# EAGLE schematic aqc-rev3 (EAGLE 9.2.2)

## Sheet 1 of 12
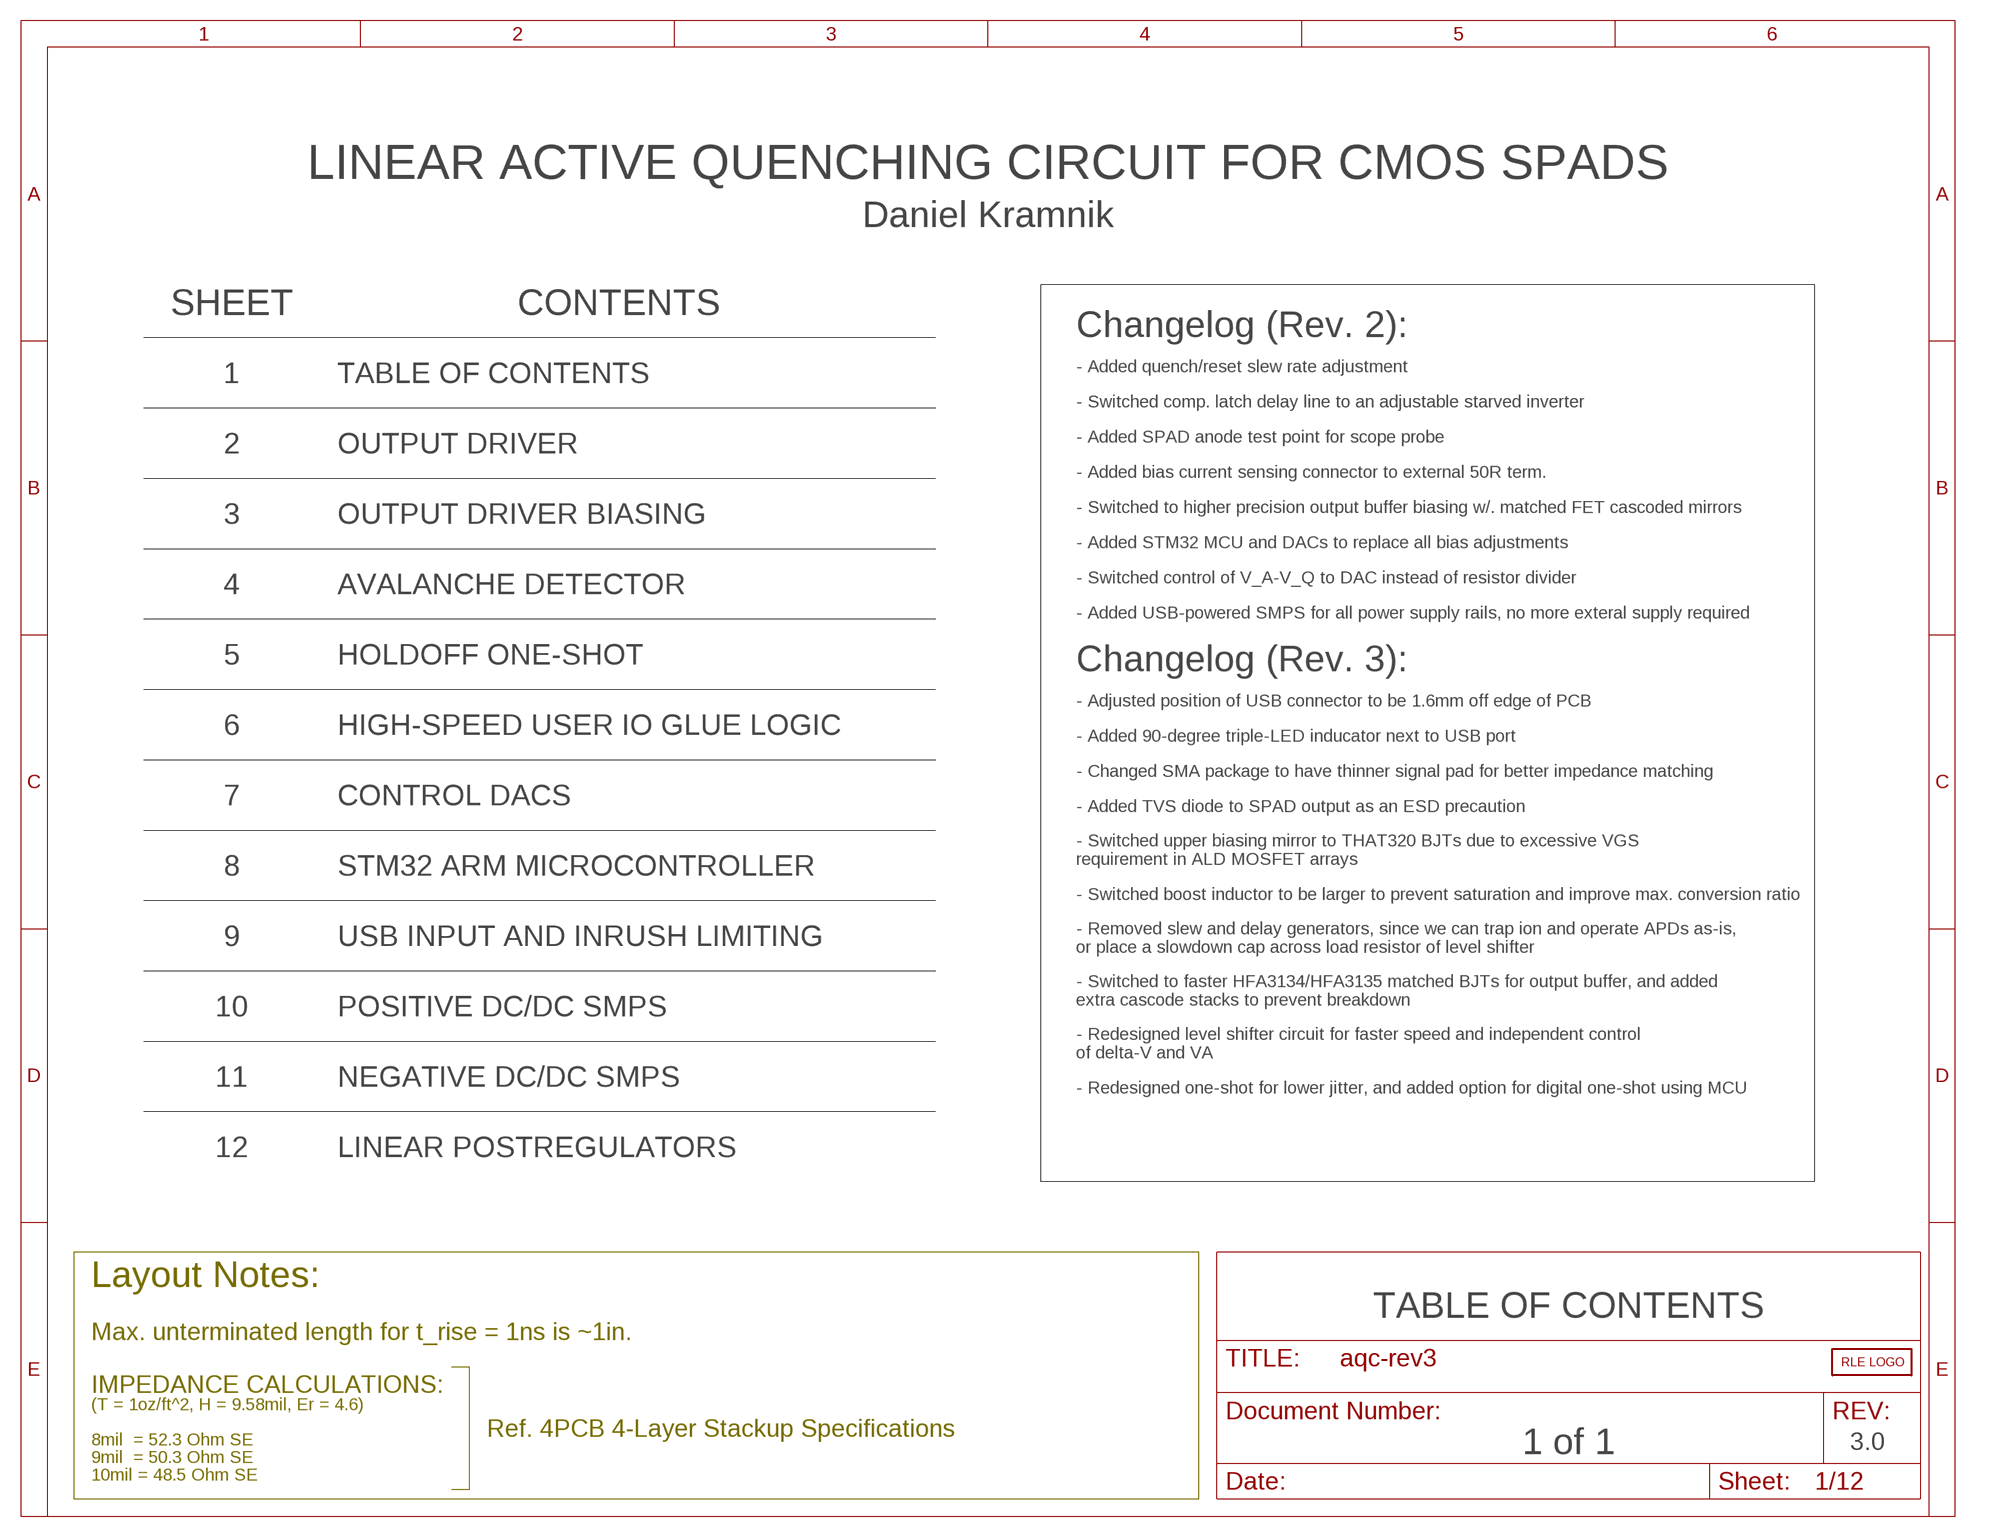
[diagram p0: schematic, sheet 1]

### Parts
DNP1000  RLE_LOGO  [RLE_LOGO]

### Notes on the sheet
- LINEAR ACTIVE QUENCHING CIRCUIT FOR CMOS SPADS
- Daniel Kramnik
- SHEET | CONTENTS
- Changelog (Rev. 2):
- 1 | TABLE OF CONTENTS | - Added quench/reset slew rate adjustment
- - Switched comp. latch delay line to an adjustable starved inverter
- 2 | OUTPUT DRIVER | - Added SPAD anode test point for scope probe
- - Added bias current sensing connector to external 50R term.
- 3 | OUTPUT DRIVER BIASING | - Switched to higher precision output buffer biasing w/. matched FET cascoded mirrors
- - Added STM32 MCU and DACs to replace all bias adjustments
- 4 | AVALANCHE DETECTOR | - Switched control of V_A-V_Q to DAC instead of resistor divider
- - Added USB-powered SMPS for all power supply rails, no more exteral supply required
- 5 | HOLDOFF ONE-SHOT
- Changelog (Rev. 3):
- - Adjusted position of USB connector to be 1.6mm off edge of PCB
- 6 | HIGH-SPEED USER IO GLUE LOGIC
- - Added 90-degree triple-LED inducator next to USB port
- - Changed SMA package to have thinner signal pad for better impedance matching
- 7 | CONTROL DACS
- - Added TVS diode to SPAD output as an ESD precaution
- 8 | STM32 ARM MICROCONTROLLER
- - Switched upper biasing mirror to THAT320 BJTs due to excessive VGS
  requirement in ALD MOSFET arrays
- - Switched boost inductor to be larger to prevent saturation and improve max. conversion ratio
- 9 | USB INPUT AND INRUSH LIMITING
- - Removed slew and delay generators, since we can trap ion and operate APDs as-is,
  or place a slowdown cap across load resistor of level shifter
- 10 | POSITIVE DC/DC SMPS
- - Switched to faster HFA3134/HFA3135 matched BJTs for output buffer, and added
  extra cascode stacks to prevent breakdown
- - Redesigned level shifter circuit for faster speed and independent control
  of delta-V and VA
- 11 | NEGATIVE DC/DC SMPS
- - Redesigned one-shot for lower jitter, and added option for digital one-shot using MCU
- 12 | LINEAR POSTREGULATORS
- Layout Notes:
- TABLE OF CONTENTS
- Max. unterminated length for t_rise = 1ns is ~1in.
- IMPEDANCE CALCULATIONS:
- (T = 1oz/ft^2, H = 9.58mil, Er = 4.6)
- Ref. 4PCB 4-Layer Stackup Specifications | 1 of 1 | 3.0
- 8mil  = 52.3 Ohm SE
- 9mil  = 50.3 Ohm SE
- 10mil = 48.5 Ohm SE

## Sheet 2 of 12
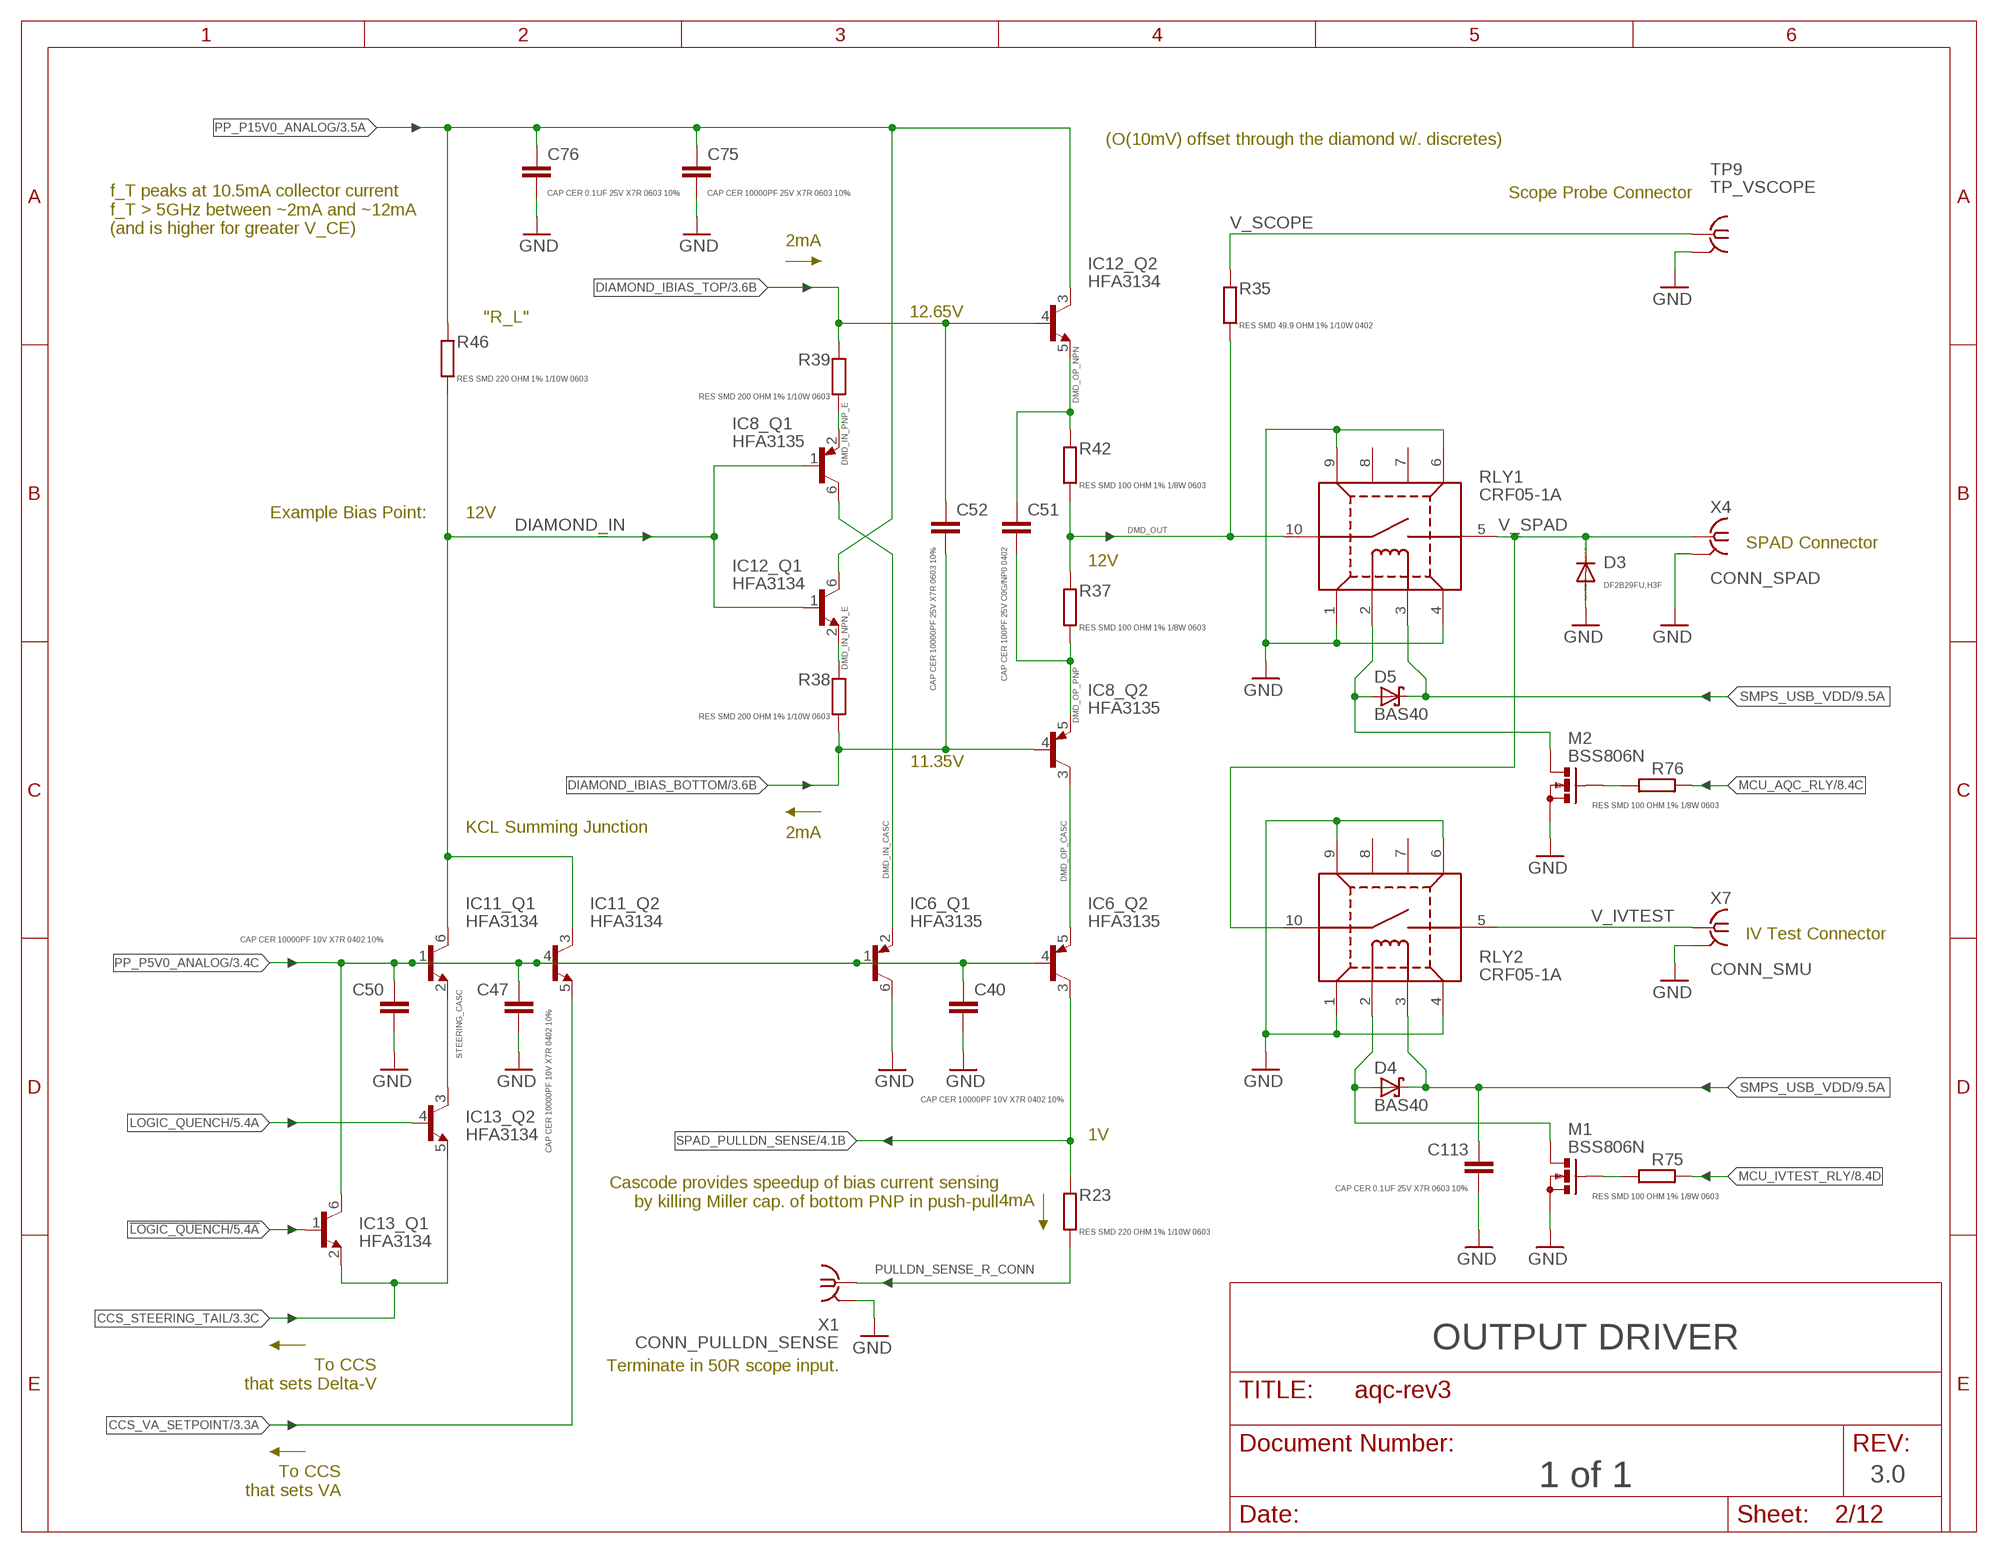
[diagram p1: schematic, sheet 2]

### Parts
C40  CAP CER 10000PF 10V X7R 0402 10%  C-EUC0402  [C0402]
C47  CAP CER 10000PF 10V X7R 0402 10%  C-EUC0402  [C0402]
C50  CAP CER 10000PF 10V X7R 0402 10%  C-EUC0402  [C0402]
C51  CAP CER 100PF 25V C0G/NP0 0402  C-EUC0402  [C0402]
C52  CAP CER 10000PF 25V X7R 0603 10%  C-EUC0603  [C0603]
C75  CAP CER 10000PF 25V X7R 0603 10%  C-EUC0603  [C0603]
C76  CAP CER 0.1UF 25V X7R 0603 10%  C-EUC0603  [C0603]
C113  CAP CER 0.1UF 25V X7R 0603 10%  C-EUC0603  [C0603]
D3  DF2B29FU,H3F  DIODE-SOD523  [SOD523]
D4  BAS40  [SOT23]
D5  BAS40  [SOT23]
IC6  HFA3135  [SOT23-6L]
IC8  HFA3135  [SOT23-6L]
IC11  HFA3134  [SOT23-6L]
IC12  HFA3134  [SOT23-6L]
IC13  HFA3134  [SOT23-6L]
M1  BSS806N  [SOT23R_INFINEON]
M2  BSS806N  [SOT23R_INFINEON]
R23  RES SMD 220 OHM 1% 1/10W 0603  R-EU_R0603  [R0603]
R35  RES SMD 49.9 OHM 1% 1/10W 0402  R-EU_R0402  [R0402]
R37  RES SMD 100 OHM 1% 1/8W 0603  R-EU_R0603  [R0603]
R38  RES SMD 200 OHM 1% 1/10W 0603  R-EU_R0603  [R0603]
R39  RES SMD 200 OHM 1% 1/10W 0603  R-EU_R0603  [R0603]
R42  RES SMD 100 OHM 1% 1/8W 0603  R-EU_R0603  [R0603]
R46  RES SMD 220 OHM 1% 1/10W 0603  R-EU_R0603  [R0603]
R75  RES SMD 100 OHM 1% 1/8W 0603  R-EU_R0603  [R0603]
R76  RES SMD 100 OHM 1% 1/8W 0603  R-EU_R0603  [R0603]
RLY1  CRF05-1A  MEDER_CRF05-1A  [MEDER_RELAY_CRF]
RLY2  CRF05-1A  MEDER_CRF05-1A  [MEDER_RELAY_CRF]
TP9  TP_VSCOPE  TP-SCOPE_H  [JOHNSON-129-0701-30X]
X1  CONN_PULLDN_SENSE  SMA-142-0701-881/886  [J502-ND-142-0701-881/886]
X4  CONN_SPAD  SMA-142-0701-881/886  [J502-ND-142-0701-881/886]
X7  CONN_SMU  SMA-142-0701-881/886  [J502-ND-142-0701-881/886]

### Nets
!LOGIC_QUENCH: IC13.1(_Q1:B) ; also sheet 5
CCS_STEERING_TAIL: IC13.2(_Q1:E) IC13.5(_Q2:E) ; also sheet 3
CCS_VA_SETPOINT: IC11.5(_Q2:E) ; also sheet 3
DIAMOND_IBIAS_BOTTOM: C52.2 IC8.4(_Q2:B) R38.1 ; also sheet 3
DIAMOND_IBIAS_TOP: C52.1 IC12.4(_Q2:B) R39.2 ; also sheet 3
DIAMOND_IN: IC8.1(_Q1:B) IC11.3(_Q2:C) IC11.6(_Q1:C) IC12.1(_Q1:B) R46.1
DMD_IN_CASC: IC6.2(_Q1:E) IC8.6(_Q1:C)
DMD_IN_NPN_E: IC12.2(_Q1:E) R38.2
DMD_IN_PNP_E: IC8.2(_Q1:E) R39.1
DMD_OP_CASC: IC6.5(_Q2:E) IC8.3(_Q2:C)
DMD_OP_NPN: C51.1 IC12.5(_Q2:E) R42.2
DMD_OP_PNP: C51.2 IC8.5(_Q2:E) R37.1
DMD_OUT: R35.1 R37.2 R42.1 RLY1.10(PIN10)
GND: C40.2 C47.2 C50.2 C75.2 C76.2 C113.2 D3.A IC6.6(_Q1:C) M1.2(S) M2.2(S) RLY1.1(PIN1) RLY1.4(PIN4) RLY1.6(PIN6) RLY1.9(PIN9) RLY2.1(PIN1) RLY2.4(PIN4) RLY2.6(PIN6) RLY2.9(PIN9) TP9.GND1(GND) TP9.GND2(GND) X1.G@1(GND) X4.G@1(GND) X7.G@1(GND) ; also sheet 3,4,5,6,7,8,9,10,11,12
LOGIC_QUENCH: IC13.4(_Q2:B) ; also sheet 5
MCU_AQC_RLY: R76.2 ; also sheet 8
MCU_IVTEST_RLY: R75.2 ; also sheet 8
N$3: M2.1(G) R76.1
N$4: D5.1(A) M2.3(D) RLY1.2(PIN2)
N$6: D4.1(A) M1.3(D) RLY2.2(PIN2)
N$15: M1.1(G) R75.1
PP_P5V0_ANALOG: C40.1 C47.1 C50.1 IC6.1(_Q1:B) IC6.4(_Q2:B) IC11.1(_Q1:B) IC11.4(_Q2:B) IC13.6(_Q1:C) ; also sheet 3,4,5,7,12
PP_P15V0_ANALOG: C75.1 C76.1 IC12.3(_Q2:C) IC12.6(_Q1:C) R46.2 ; also sheet 3,12
PULLDN_SENSE_R_CONN: R23.1 X1.1
SMPS_USB_VDD: C113.1 D4.3(C) D5.3(C) RLY1.3(PIN3) RLY2.3(PIN3) ; also sheet 9,10,11
SPAD_PULLDN_SENSE: IC6.3(_Q2:C) R23.2 ; also sheet 4
STEERING_CASC: IC11.2(_Q1:E) IC13.3(_Q2:C)
V_IVTEST: RLY2.5(PIN5) X7.1
V_SCOPE: R35.2 TP9.SIG
V_SPAD: D3.C RLY1.5(PIN5) RLY2.10(PIN10) X4.1
Unconnected: RLY1.7(PIN7) RLY1.8(PIN8) RLY2.7(PIN7) RLY2.8(PIN8)

### Notes on the sheet
- (O(10mV) offset through the diamond w/. discretes)
- Scope Probe Connector
- f_T peaks at 10.5mA collector current
  f_T > 5GHz between ~2mA and ~12mA
  (and is higher for greater V_CE)
- 2mA
- 12.65V
- "R_L"
- Example Bias Point: | 12V
- SPAD Connector
- 12V
- 11.35V
- KCL Summing Junction
- 2mA
- IV Test Connector
- 1V
- Cascode provides speedup of bias current sensing
  by killing Miller cap. of bottom PNP in push-pull
- 4mA
- OUTPUT DRIVER
- Terminate in 50R scope input.
- To CCS
  that sets Delta-V
- 1 of 1 | 3.0
- To CCS
  that sets VA

## Sheet 3 of 12
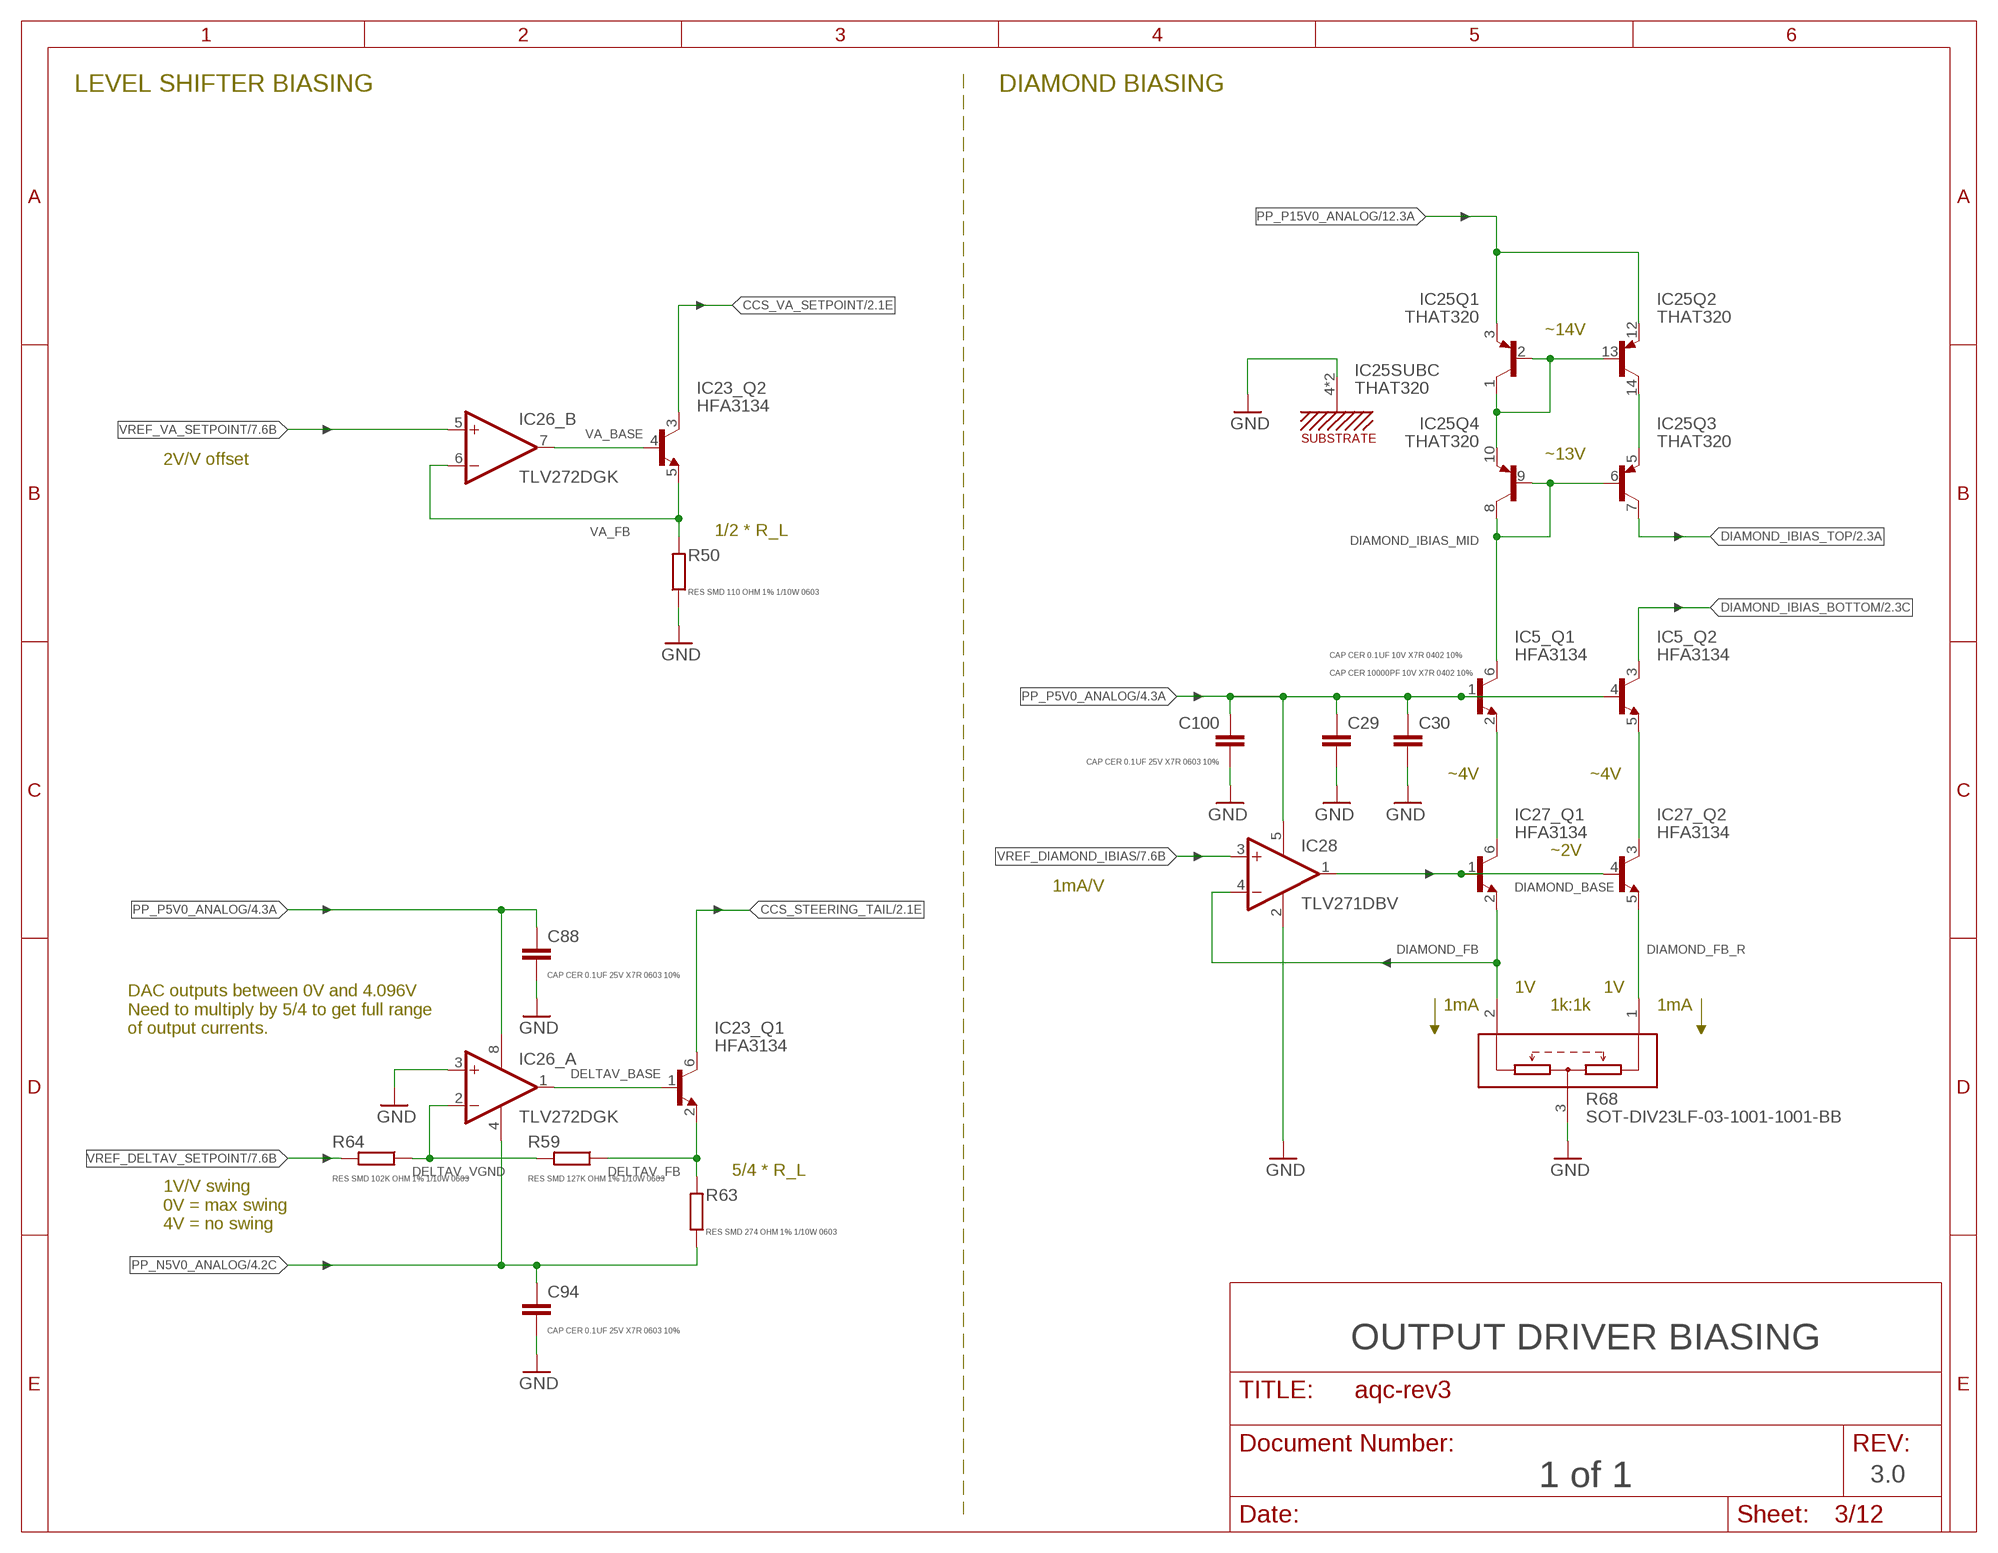
[diagram p2: schematic, sheet 3]

### Parts
C29  CAP CER 0.1UF 10V X7R 0402 10%  C-EUC0402  [C0402]
C30  CAP CER 10000PF 10V X7R 0402 10%  C-EUC0402  [C0402]
C88  CAP CER 0.1UF 25V X7R 0603 10%  C-EUC0603  [C0603]
C94  CAP CER 0.1UF 25V X7R 0603 10%  C-EUC0603  [C0603]
C100  CAP CER 0.1UF 25V X7R 0603 10%  C-EUC0603  [C0603]
IC5  HFA3134  [SOT23-6L]
IC23  HFA3134  [SOT23-6L]
IC25  THAT320  [SO14]
IC26  TLV272DGK  [MSOP8]
IC27  HFA3134  [SOT23-6L]
IC28  TLV271DBV  [SOT23-5]
R50  RES SMD 110 OHM 1% 1/10W 0603  R-EU_R0603  [R0603]
R59  RES SMD 127K OHM 1% 1/10W 0603  R-EU_R0603  [R0603]
R63  RES SMD 274 OHM 1% 1/10W 0603  R-EU_R0603  [R0603]
R64  RES SMD 102K OHM 1% 1/10W 0603  R-EU_R0603  [R0603]
R68  SOT-DIV23LF-03-1001-1001-BB  DIVIDER_SOT23-5  [SOT23C]

### Nets
CCS_STEERING_TAIL: IC23.6(_Q1:C) ; also sheet 2
CCS_VA_SETPOINT: IC23.3(_Q2:C) ; also sheet 2
DELTAV_BASE: IC23.1(_Q1:B) IC26.1(_A:OUT)
DELTAV_FB: IC23.2(_Q1:E) R59.1 R63.2
DELTAV_VGND: IC26.2(_A:-IN) R59.2 R64.1
DIAMOND_BASE: IC27.1(_Q1:B) IC27.4(_Q2:B) IC28.1(OUT)
DIAMOND_FB: IC27.2(_Q1:E) IC28.4(-IN) R68.2(TOP)
DIAMOND_FB_R: IC27.5(_Q2:E) R68.1(BOTTOM)
DIAMOND_IBIAS_BOTTOM: IC5.3(_Q2:C) ; also sheet 2
DIAMOND_IBIAS_MID: IC5.6(_Q1:C) IC25.6(Q3:B) IC25.8(Q4:C) IC25.9(Q4:B)
DIAMOND_IBIAS_TOP: IC25.7(Q3:C) ; also sheet 2
GND: C29.2 C30.2 C88.2 C94.2 C100.2 IC25.4(SUBC:SUBC) IC25.11(SUBC:SUBC) IC26.3(_A:+IN) IC28.2(V-) R50.1 R68.3(MIDDLE) ; also sheet 2,4,5,6,7,8,9,10,11,12
N$16: IC5.2(_Q1:E) IC27.6(_Q1:C)
N$26: IC5.5(_Q2:E) IC27.3(_Q2:C)
N$88: IC25.1(Q1:C) IC25.2(Q1:B) IC25.10(Q4:E) IC25.13(Q2:B)
N$89: IC25.5(Q3:E) IC25.14(Q2:C)
PP_N5V0_ANALOG: C94.1 IC26.4(_A:V-) R63.1 ; also sheet 4,5,12
PP_P5V0_ANALOG: C29.1 C30.1 C88.1 C100.1 IC5.1(_Q1:B) IC5.4(_Q2:B) IC26.8(_A:V+) IC28.5(V+) ; also sheet 2,4,5,7,12
PP_P15V0_ANALOG: IC25.3(Q1:E) IC25.12(Q2:E) ; also sheet 2,12
VA_BASE: IC23.4(_Q2:B) IC26.7(_B:OUT)
VA_FB: IC23.5(_Q2:E) IC26.6(_B:-IN) R50.2
VREF_DELTAV_SETPOINT: R64.2 ; also sheet 7
VREF_DIAMOND_IBIAS: IC28.3(+IN) ; also sheet 7
VREF_VA_SETPOINT: IC26.5(_B:+IN) ; also sheet 7

### Notes on the sheet
- LEVEL SHIFTER BIASING | DIAMOND BIASING
- ~14V
- ~13V
- 2V/V offset
- 1/2 * R_L
- ~4V | ~4V
- ~2V
- 1mA/V
- 1V | 1V
- 1mA | 1k:1k | 1mA
- DAC outputs between 0V and 4.096V
  Need to multiply by 5/4 to get full range
  of output currents.
- 5/4 * R_L
- 1V/V swing
  0V = max swing
  4V = no swing
- OUTPUT DRIVER BIASING
- 1 of 1 | 3.0

## Sheet 4 of 12
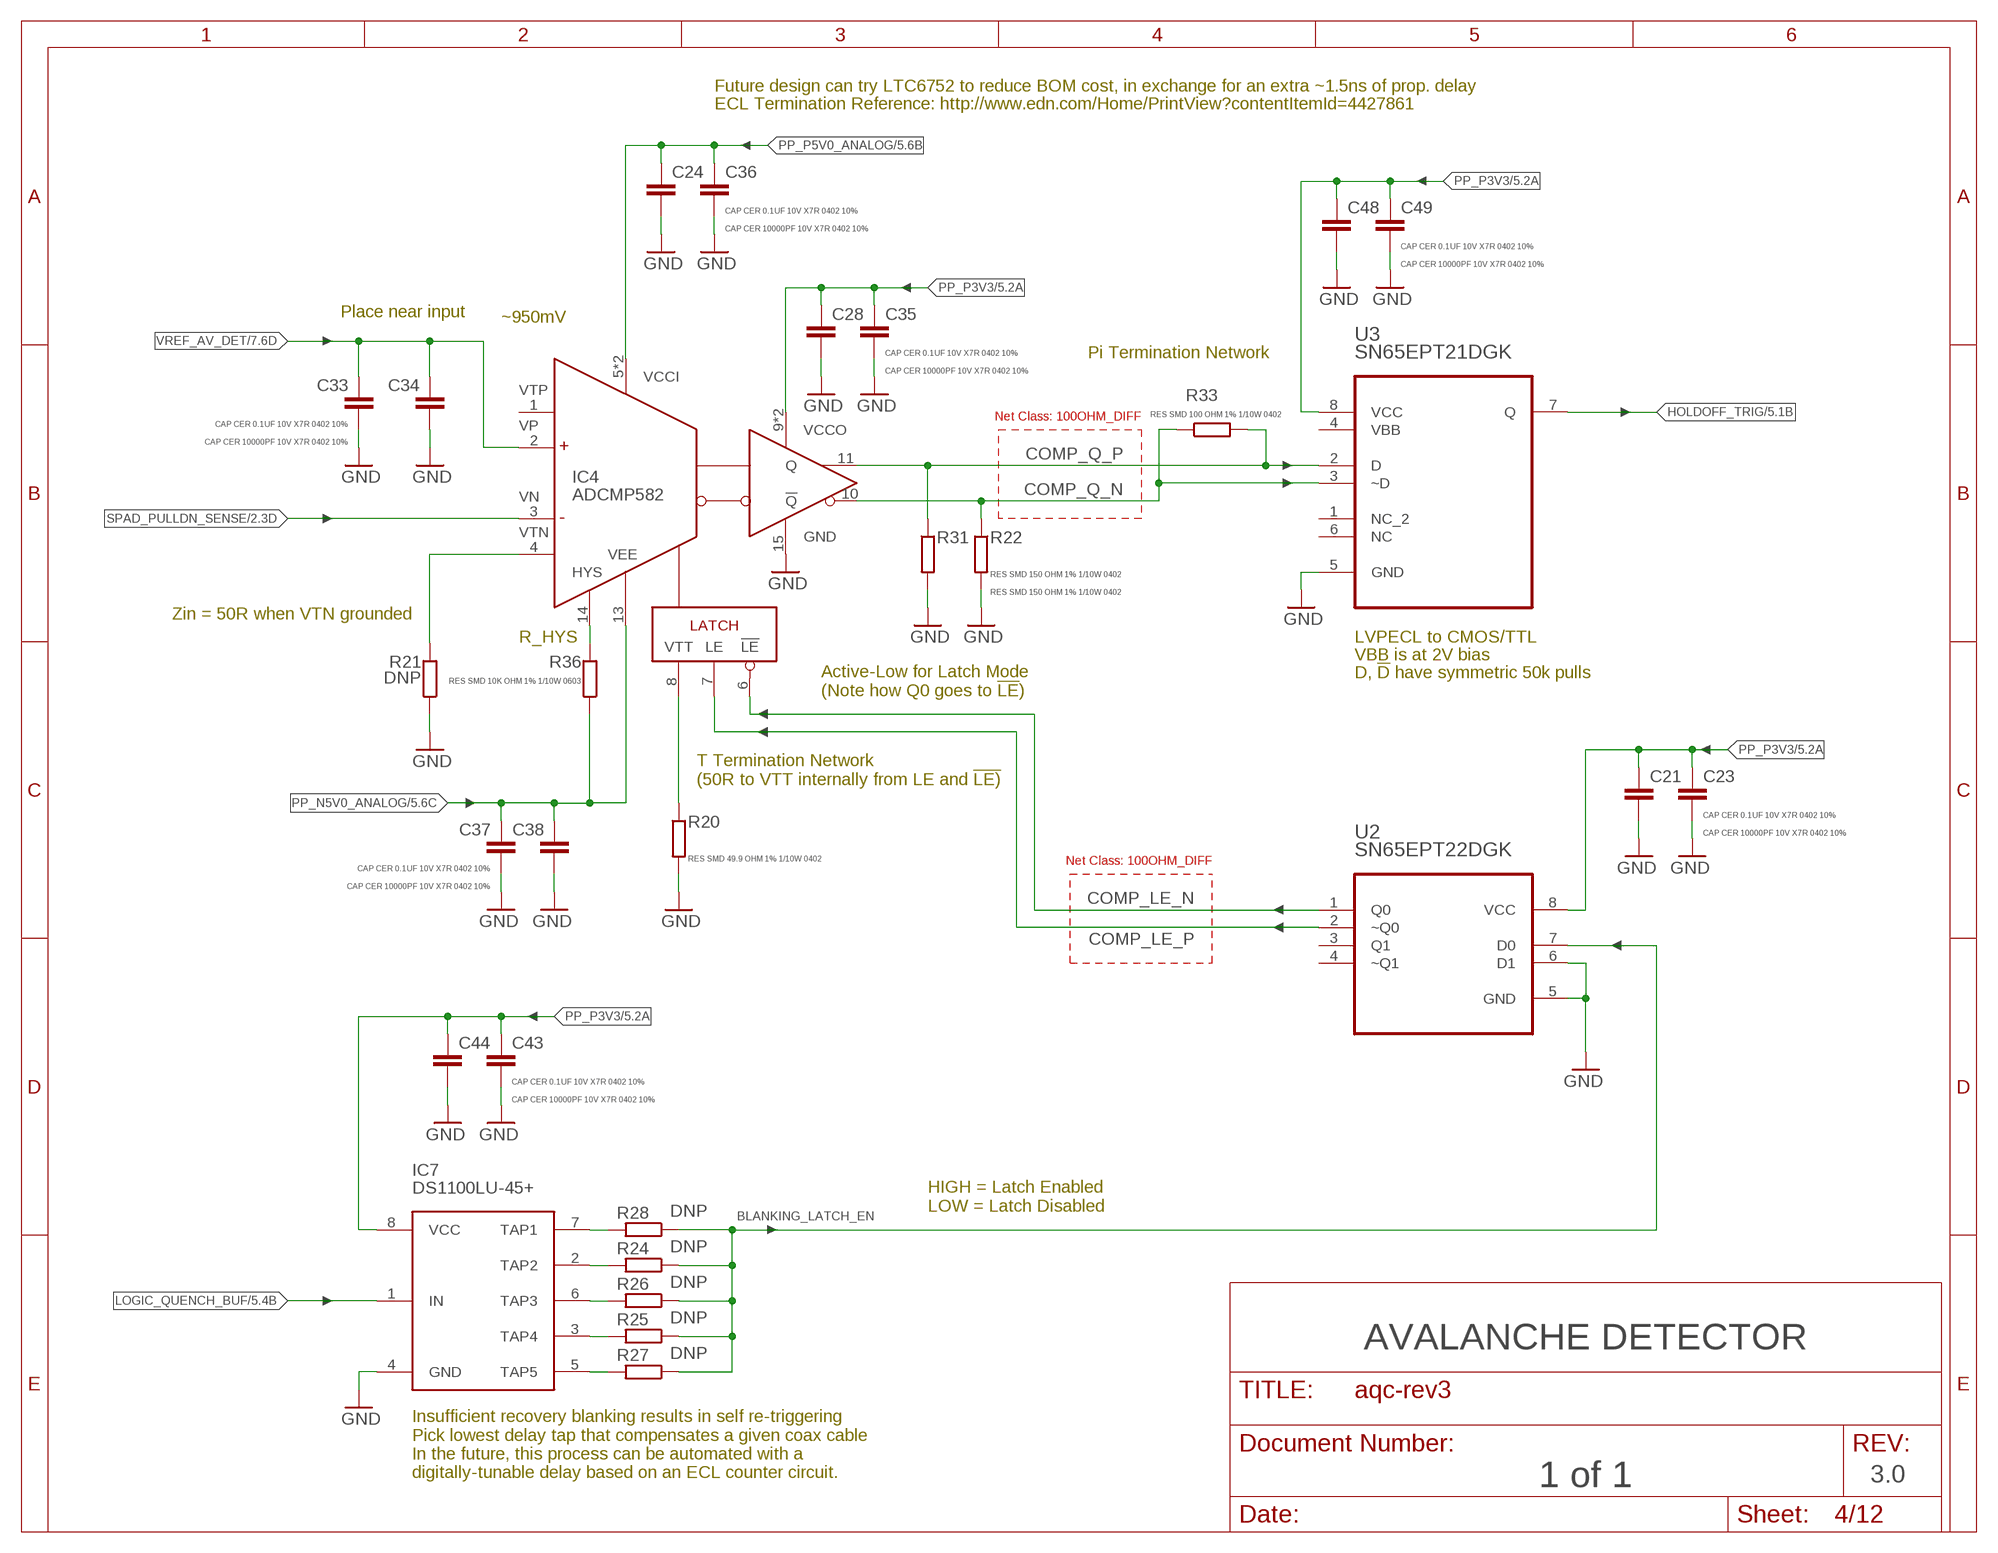
[diagram p3: schematic, sheet 4]

### Parts
C21  CAP CER 10000PF 10V X7R 0402 10%  C-EUC0402  [C0402]
C23  CAP CER 0.1UF 10V X7R 0402 10%  C-EUC0402  [C0402]
C24  CAP CER 10000PF 10V X7R 0402 10%  C-EUC0402  [C0402]
C28  CAP CER 10000PF 10V X7R 0402 10%  C-EUC0402  [C0402]
C33  CAP CER 0.1UF 10V X7R 0402 10%  C-EUC0402  [C0402]
C34  CAP CER 10000PF 10V X7R 0402 10%  C-EUC0402  [C0402]
C35  CAP CER 0.1UF 10V X7R 0402 10%  C-EUC0402  [C0402]
C36  CAP CER 0.1UF 10V X7R 0402 10%  C-EUC0402  [C0402]
C37  CAP CER 0.1UF 10V X7R 0402 10%  C-EUC0402  [C0402]
C38  CAP CER 10000PF 10V X7R 0402 10%  C-EUC0402  [C0402]
C43  CAP CER 0.1UF 10V X7R 0402 10%  C-EUC0402  [C0402]
C44  CAP CER 10000PF 10V X7R 0402 10%  C-EUC0402  [C0402]
C48  CAP CER 10000PF 10V X7R 0402 10%  C-EUC0402  [C0402]
C49  CAP CER 0.1UF 10V X7R 0402 10%  C-EUC0402  [C0402]
IC4  ADCMP582  [QFN50P300X300X80-16N]
IC7  DS1100LU-45+  DS1100L  [MSOP8]
R20  RES SMD 49.9 OHM 1% 1/10W 0402  R-EU_R0402  [R0402]
R21  DNP  R-EU_R0603  [R0603]
R22  RES SMD 150 OHM 1% 1/10W 0402  R-EU_R0402  [R0402]
R24  DNP  R-EU_R0603  [R0603]
R25  DNP  R-EU_R0603  [R0603]
R26  DNP  R-EU_R0603  [R0603]
R27  DNP  R-EU_R0603  [R0603]
R28  DNP  R-EU_R0603  [R0603]
R31  RES SMD 150 OHM 1% 1/10W 0402  R-EU_R0402  [R0402]
R33  RES SMD 100 OHM 1% 1/10W 0402  R-EU_R0402  [R0402]
R36  RES SMD 10K OHM 1% 1/10W 0603  R-EU_R0603  [R0603]
U2  SN65EPT22DGK  [SOP65P490X110-8N]
U3  SN65EPT21DGK  [SOP65P490X110-8N]

### Nets
BLANKING_LATCH_EN: R24.1 R25.1 R26.1 R27.1 R28.1 U2.7(D0)
COMP_HYS: IC4.14(HYS) R36.2
COMP_LE_N [100OHM_DIFF]: IC4.6(!LE) U2.1(Q0)
COMP_LE_P [100OHM_DIFF]: IC4.7(LE) U2.2(~Q0)
COMP_Q_N [100OHM_DIFF]: IC4.10(!Q) R22.1 R33.1 U3.3(~D)
COMP_Q_P [100OHM_DIFF]: IC4.11(Q) R31.1 R33.2 U3.2(D)
COMP_VTN: IC4.4(VTN) R21.2
COMP_VTT: IC4.8(VTT) R20.1
GND: C21.2 C23.2 C24.2 C28.2 C33.2 C34.2 C35.2 C36.2 C37.2 C38.2 C43.2 C44.2 C48.2 C49.2 IC4.15(GND) IC7.4(GND) R20.2 R21.1 R22.2 R31.2 U2.5(GND) U2.6(D1) U3.5(GND) ; also sheet 2,3,5,6,7,8,9,10,11,12
HOLDOFF_TRIG: U3.7(Q) ; also sheet 5
LOGIC_QUENCH_BUF: IC7.1(IN) ; also sheet 5,6
PP_N5V0_ANALOG: C37.1 C38.1 IC4.13(VEE) R36.1 ; also sheet 3,5,12
PP_P3V3: C21.1 C23.1 C28.1 C35.1 C43.1 C44.1 C48.1 C49.1 IC4.9(VCCO) IC4.12(VCCO) IC7.8(VCC) U2.8(VCC) U3.8(VCC) ; also sheet 5,6,7,8,9
PP_P5V0_ANALOG: C24.1 C36.1 IC4.5(VCCI) IC4.16(VCCI) ; also sheet 2,3,5,7,12
SPAD_PULLDN_SENSE: IC4.3(VN) ; also sheet 2
TAP1: IC7.7(TAP1) R28.2
TAP2: IC7.2(TAP2) R24.2
TAP3: IC7.6(TAP3) R26.2
TAP4: IC7.3(TAP4) R25.2
TAP5: IC7.5(TAP5) R27.2
VREF_AV_DET: C33.1 C34.1 IC4.2(VP) ; also sheet 7
Unconnected: IC4.1(VTP) U2.3(Q1) U2.4(~Q1) U3.1(NC_2) U3.6(NC)

### Notes on the sheet
- Future design can try LTC6752 to reduce BOM cost, in exchange for an extra ~1.5ns of prop. delay
- ECL Termination Reference: http://www.edn.com/Home/PrintView?contentItemId=4427861
- Place near input
- ~950mV
- Pi Termination Network
- Net Class: 100OHM_DIFF
- Zin = 50R when VTN grounded
- R_HYS | LVPECL to CMOS/TTL
- VBB is at 2V bias
- D, !D! have symmetric 50k pulls
- Active-Low for Latch Mode
  (Note how Q0 goes to !LE!)
- T Termination Network
  (50R to VTT internally from LE and !LE)
- Net Class: 100OHM_DIFF
- HIGH = Latch Enabled
  LOW = Latch Disabled
- AVALANCHE DETECTOR
- 1 of 1 | 3.0
- Insufficient recovery blanking results in self re-triggering
  Pick lowest delay tap that compensates a given coax cable
  In the future, this process can be automated with a
  digitally-tunable delay based on an ECL counter circuit.

## Sheet 5 of 12
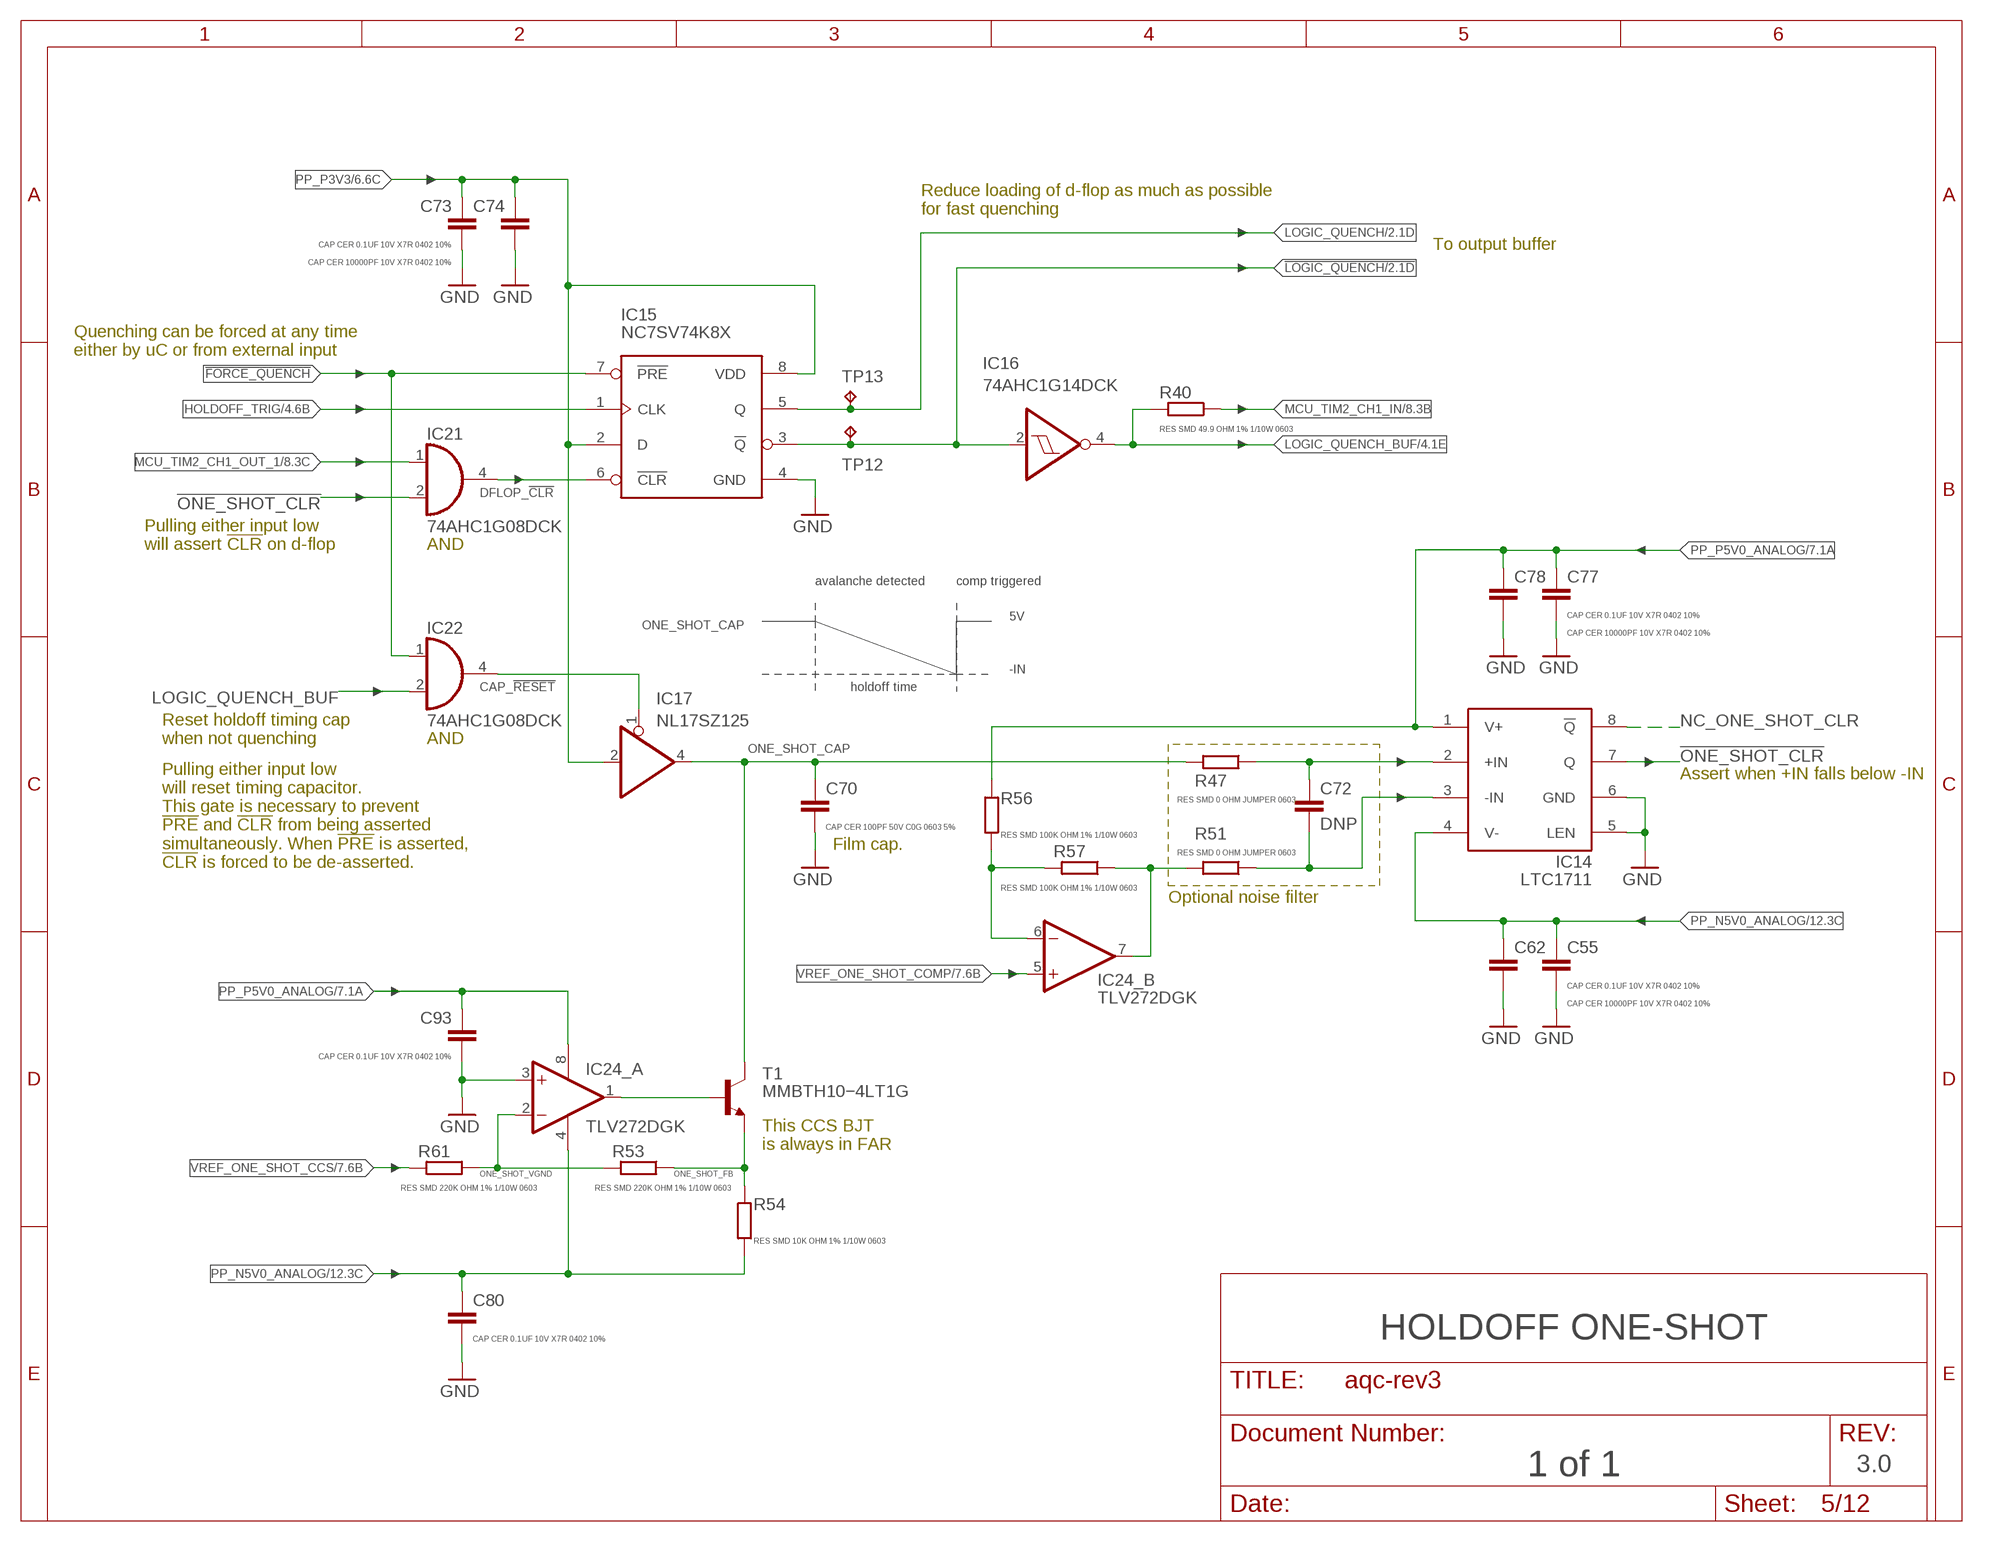
[diagram p4: schematic, sheet 5]

### Parts
C55  CAP CER 0.1UF 10V X7R 0402 10%  C-EUC0402  [C0402]
C62  CAP CER 10000PF 10V X7R 0402 10%  C-EUC0402  [C0402]
C70  CAP CER 100PF 50V C0G 0603 5%  C-EUC0603  [C0603]
C72  DNP  C-EUC0402  [C0402]
C73  CAP CER 0.1UF 10V X7R 0402 10%  C-EUC0402  [C0402]
C74  CAP CER 10000PF 10V X7R 0402 10%  C-EUC0402  [C0402]
C77  CAP CER 0.1UF 10V X7R 0402 10%  C-EUC0402  [C0402]
C78  CAP CER 10000PF 10V X7R 0402 10%  C-EUC0402  [C0402]
C80  CAP CER 0.1UF 10V X7R 0402 10%  C-EUC0402  [C0402]
C93  CAP CER 0.1UF 10V X7R 0402 10%  C-EUC0402  [C0402]
IC14  LTC1711  [MSOP8]
IC15  NC7SV74K8X  [US8_3.1MM_JDEC_MO-187]
IC16  74AHC1G14DCK  [SC70-5]
IC17  NL17SZ125  74AHC1G125DCK  [SC70-5]
IC21  74AHC1G08DCK  [SC70-5]
IC22  74AHC1G08DCK  [SC70-5]
IC24  TLV272DGK  [MSOP8]
R40  RES SMD 49.9 OHM 1% 1/10W 0603  R-EU_R0603  [R0603]
R47  RES SMD 0 OHM JUMPER 0603  R-EU_R0603  [R0603]
R51  RES SMD 0 OHM JUMPER 0603  R-EU_R0603  [R0603]
R53  RES SMD 220K OHM 1% 1/10W 0603  R-EU_R0603  [R0603]
R54  RES SMD 10K OHM 1% 1/10W 0603  R-EU_R0603  [R0603]
R56  RES SMD 100K OHM 1% 1/10W 0603  R-EU_R0603  [R0603]
R57  RES SMD 100K OHM 1% 1/10W 0603  R-EU_R0603  [R0603]
R61  RES SMD 220K OHM 1% 1/10W 0603  R-EU_R0603  [R0603]
T1  MMBTH10−4LT1G  MMBTH10LT1-NPN-SOT23-BEC  [SOT23-BEC]
TP12  TPTP06R  [TP06R]
TP13  TPTP06R  [TP06R]

### Nets
!FORCE_QUENCH: IC15.7(!PRE) IC22.1(I0) ; also sheet 6
!LOGIC_QUENCH: IC15.3(!Q) IC16.2(I) TP12.TP ; also sheet 2
!ONE_SHOT_CLR: IC14.7(Q) IC21.2(I1)
CAP_!RESET: IC17.1(OE) IC22.4(O)
DFLOP_!CLR: IC15.6(!CLR) IC21.4(O)
GND: C55.2 C62.2 C70.2 C73.2 C74.2 C77.2 C78.2 C80.2 C93.2 IC14.5(LEN) IC14.6(GND) IC15.4(GND) IC24.3(_A:+IN) ; also sheet 2,3,4,6,7,8,9,10,11,12
HOLDOFF_TRIG: IC15.1(CLK) ; also sheet 4
LOGIC_QUENCH: IC15.5(Q) TP13.TP ; also sheet 2
LOGIC_QUENCH_BUF: IC16.4(O) IC22.2(I1) R40.2 ; also sheet 4,6
MCU_TIM2_CH1_IN: R40.1 ; also sheet 8
MCU_TIM2_CH1_OUT_1: IC21.1(I0) ; also sheet 8
N$5: IC24.1(_A:OUT) T1.B
N$7: IC24.7(_B:OUT) R51.2 R57.1
N$10: IC24.6(_B:-IN) R56.1 R57.2
N$11: C72.2 IC14.3(-IN) R51.1
N$13: C72.1 IC14.2(+IN) R47.1
NC_ONE_SHOT_CLR: IC14.8(!Q)
ONE_SHOT_CAP: C70.1 IC17.4(O) R47.2 T1.C
ONE_SHOT_FB: R53.1 R54.1 T1.E
ONE_SHOT_VGND: IC24.2(_A:-IN) R53.2 R61.1
PP_N5V0_ANALOG: C55.1 C62.1 C80.1 IC14.4(V-) IC24.4(_A:V-) R54.2 ; also sheet 3,4,12
PP_P3V3: C73.1 C74.1 IC15.2(D) IC15.8(VDD) IC17.2(I) ; also sheet 4,6,7,8,9
PP_P5V0_ANALOG: C77.1 C78.1 C93.1 IC14.1(V+) IC24.8(_A:V+) R56.2 ; also sheet 2,3,4,7,12
VREF_ONE_SHOT_CCS: R61.2 ; also sheet 7
VREF_ONE_SHOT_COMP: IC24.5(_B:+IN) ; also sheet 7

### Notes on the sheet
- Reduce loading of d-flop as much as possible
  for fast quenching
- To output buffer
- Quenching can be forced at any time
  either by uC or from external input
- Pulling either input low
  will assert !CLR! on d-flop
- AND
- avalanche detected | comp triggered
- ONE_SHOT_CAP | 5V
- -IN
- holdoff time
- Reset holdoff timing cap
  when not quenching
- AND
- Assert when +IN falls below -IN
- Film cap.
- Pulling either input low
  will reset timing capacitor.
  This gate is necessary to prevent
  !PRE! and !CLR! from being asserted
  simultaneously. When !PRE! is asserted,
  !CLR! is forced to be de-asserted.
- Optional noise filter
- This CCS BJT
  is always in FAR
- HOLDOFF ONE-SHOT
- 1 of 1 | 3.0

## Sheet 6 of 12
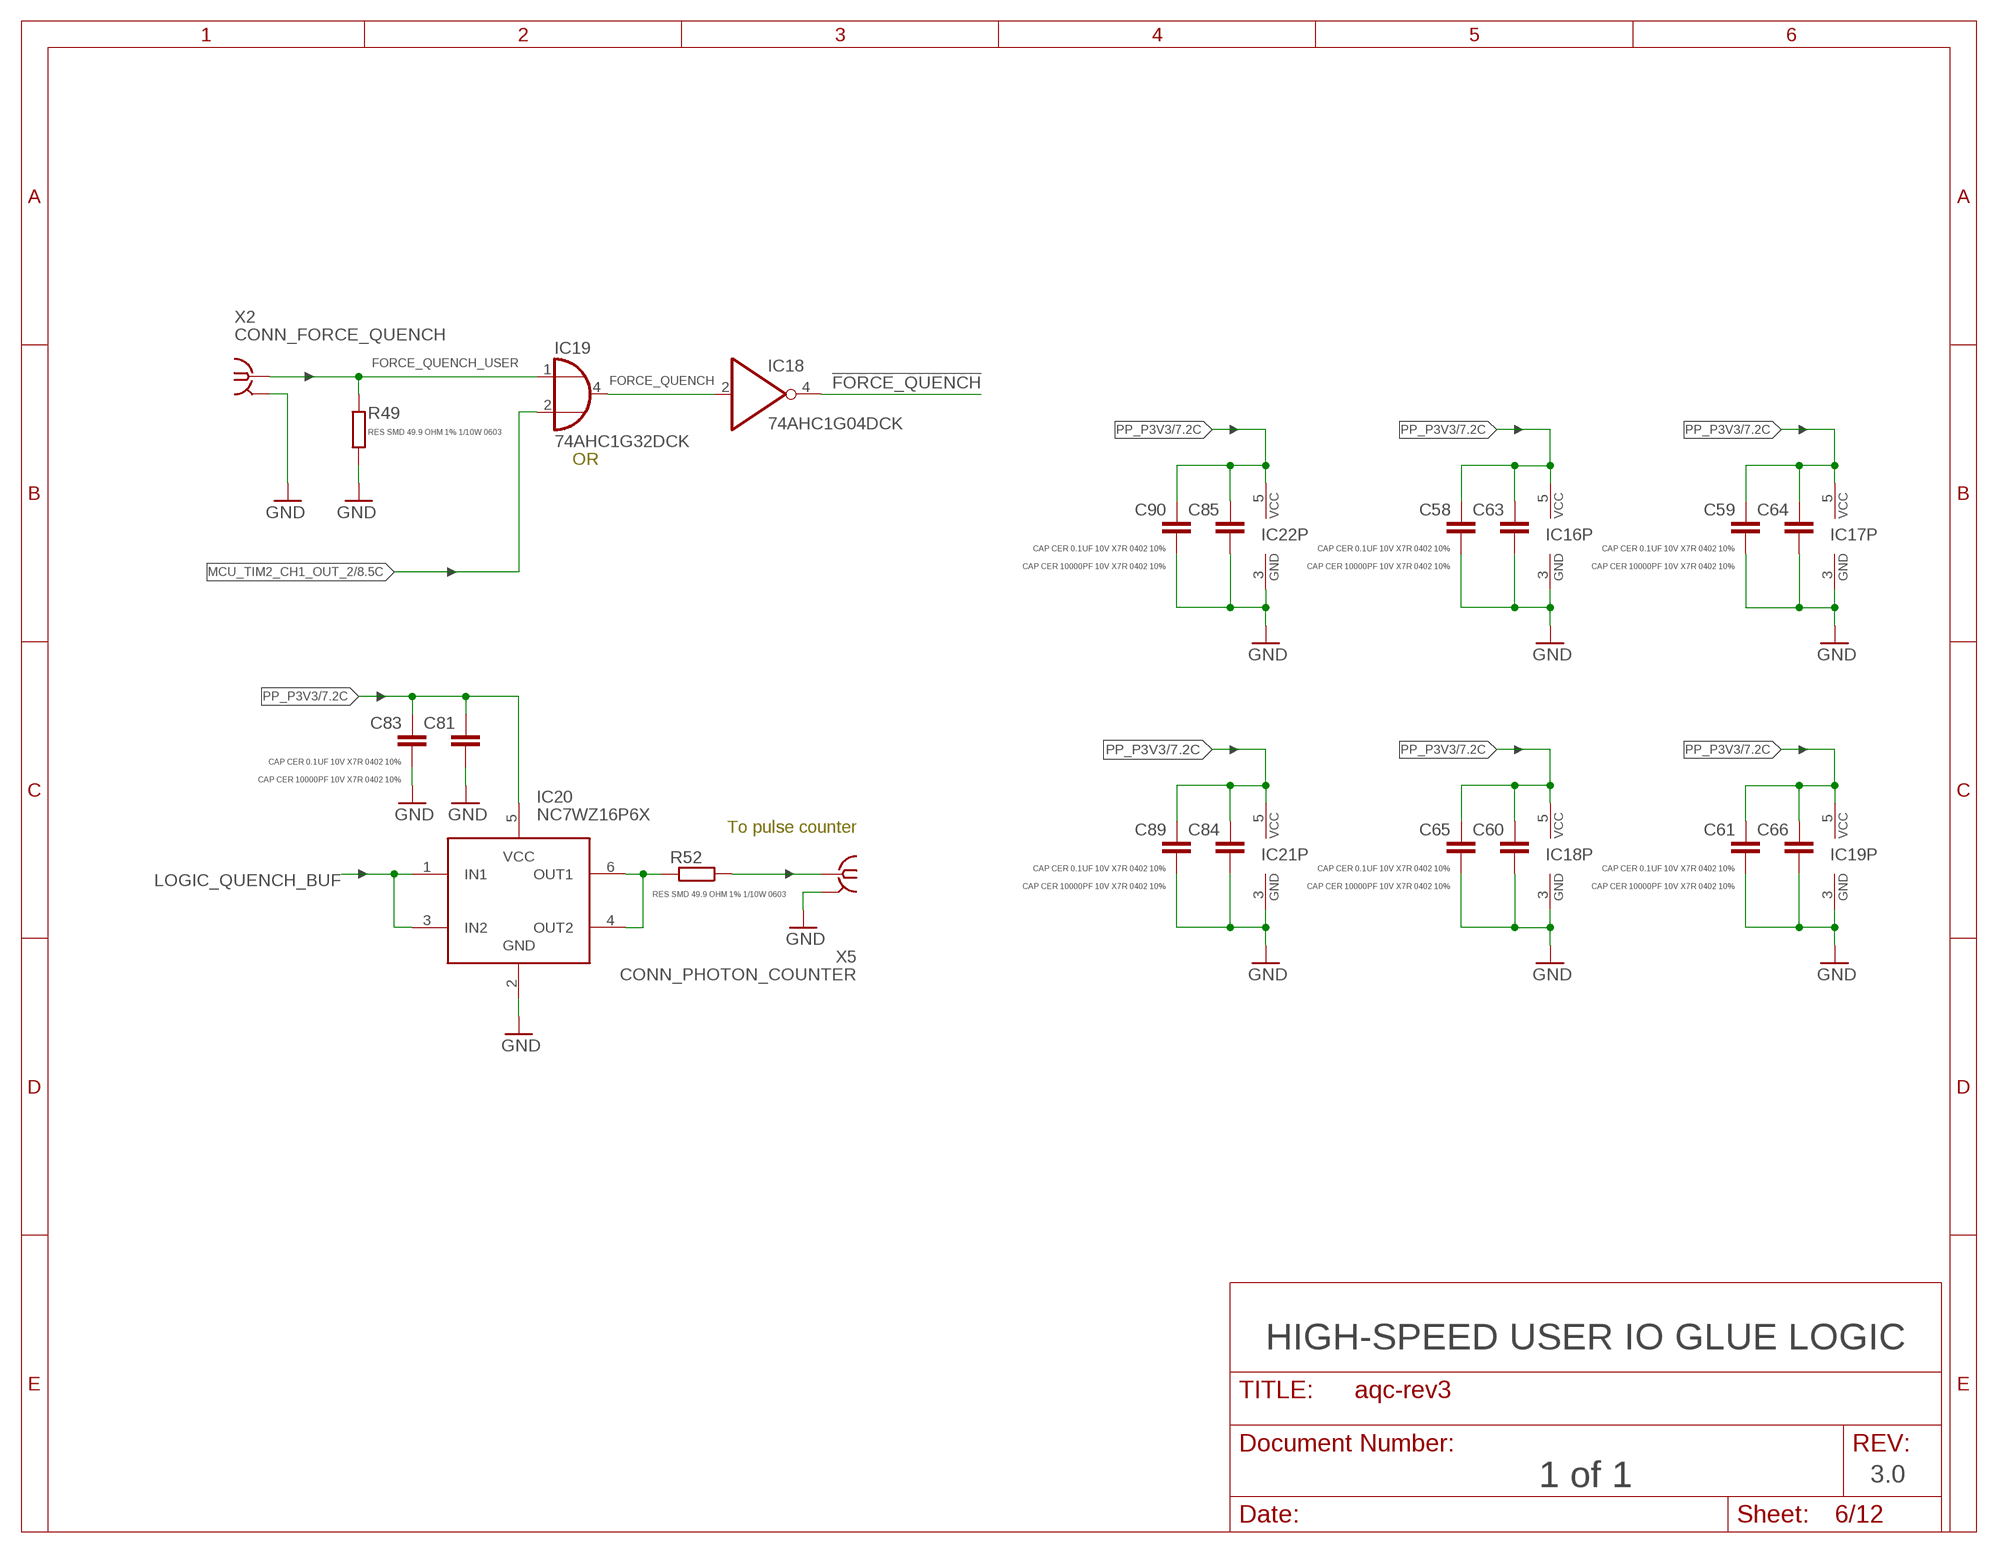
[diagram p5: schematic, sheet 6]

### Parts
C58  CAP CER 0.1UF 10V X7R 0402 10%  C-EUC0402  [C0402]
C59  CAP CER 0.1UF 10V X7R 0402 10%  C-EUC0402  [C0402]
C60  CAP CER 10000PF 10V X7R 0402 10%  C-EUC0402  [C0402]
C61  CAP CER 0.1UF 10V X7R 0402 10%  C-EUC0402  [C0402]
C63  CAP CER 10000PF 10V X7R 0402 10%  C-EUC0402  [C0402]
C64  CAP CER 10000PF 10V X7R 0402 10%  C-EUC0402  [C0402]
C65  CAP CER 0.1UF 10V X7R 0402 10%  C-EUC0402  [C0402]
C66  CAP CER 10000PF 10V X7R 0402 10%  C-EUC0402  [C0402]
C81  CAP CER 10000PF 10V X7R 0402 10%  C-EUC0402  [C0402]
C83  CAP CER 0.1UF 10V X7R 0402 10%  C-EUC0402  [C0402]
C84  CAP CER 10000PF 10V X7R 0402 10%  C-EUC0402  [C0402]
C85  CAP CER 10000PF 10V X7R 0402 10%  C-EUC0402  [C0402]
C89  CAP CER 0.1UF 10V X7R 0402 10%  C-EUC0402  [C0402]
C90  CAP CER 0.1UF 10V X7R 0402 10%  C-EUC0402  [C0402]
IC18  74AHC1G04DCK  [SC70-5]
IC19  74AHC1G32DCK  [SC70-5]
IC20  NC7WZ16P6X  [SC70-6L]
R49  RES SMD 49.9 OHM 1% 1/10W 0603  R-EU_R0603  [R0603]
R52  RES SMD 49.9 OHM 1% 1/10W 0603  R-EU_R0603  [R0603]
X2  CONN_FORCE_QUENCH  SMA-142-0701-881/886  [J502-ND-142-0701-881/886]
X5  CONN_PHOTON_COUNTER  SMA-142-0701-881/886  [J502-ND-142-0701-881/886]

### Nets
!FORCE_QUENCH: IC18.4(O) ; also sheet 5
FORCE_QUENCH: IC18.2(I) IC19.4(O)
FORCE_QUENCH_USER: IC19.1(I0) R49.2 X2.1
GND: C58.2 C59.2 C60.2 C61.2 C63.2 C64.2 C65.2 C66.2 C81.2 C83.2 C84.2 C85.2 C89.2 C90.2 IC16.3(GND) IC17.3(GND) IC18.3(GND) IC19.3(GND) IC20.2(GND) IC21.3(GND) IC22.3(GND) R49.1 X2.G@1(GND) X5.G@1(GND) ; also sheet 2,3,4,5,7,8,9,10,11,12
LOGIC_QUENCH_BUF: IC20.1(IN1) IC20.3(IN2) ; also sheet 4,5
MCU_TIM2_CH1_OUT_2: IC19.2(I1) ; also sheet 8
N$29: IC20.4(OUT2) IC20.6(OUT1) R52.2
PHOTON_COUNT_OUT: R52.1 X5.1
PP_P3V3: C58.1 C59.1 C60.1 C61.1 C63.1 C64.1 C65.1 C66.1 C81.1 C83.1 C84.1 C85.1 C89.1 C90.1 IC16.5(VCC) IC17.5(VCC) IC18.5(VCC) IC19.5(VCC) IC20.5(VCC) IC21.5(VCC) IC22.5(VCC) ; also sheet 4,5,7,8,9

### Notes on the sheet
- OR
- To pulse counter
- HIGH-SPEED USER IO GLUE LOGIC
- 1 of 1 | 3.0

## Sheet 7 of 12
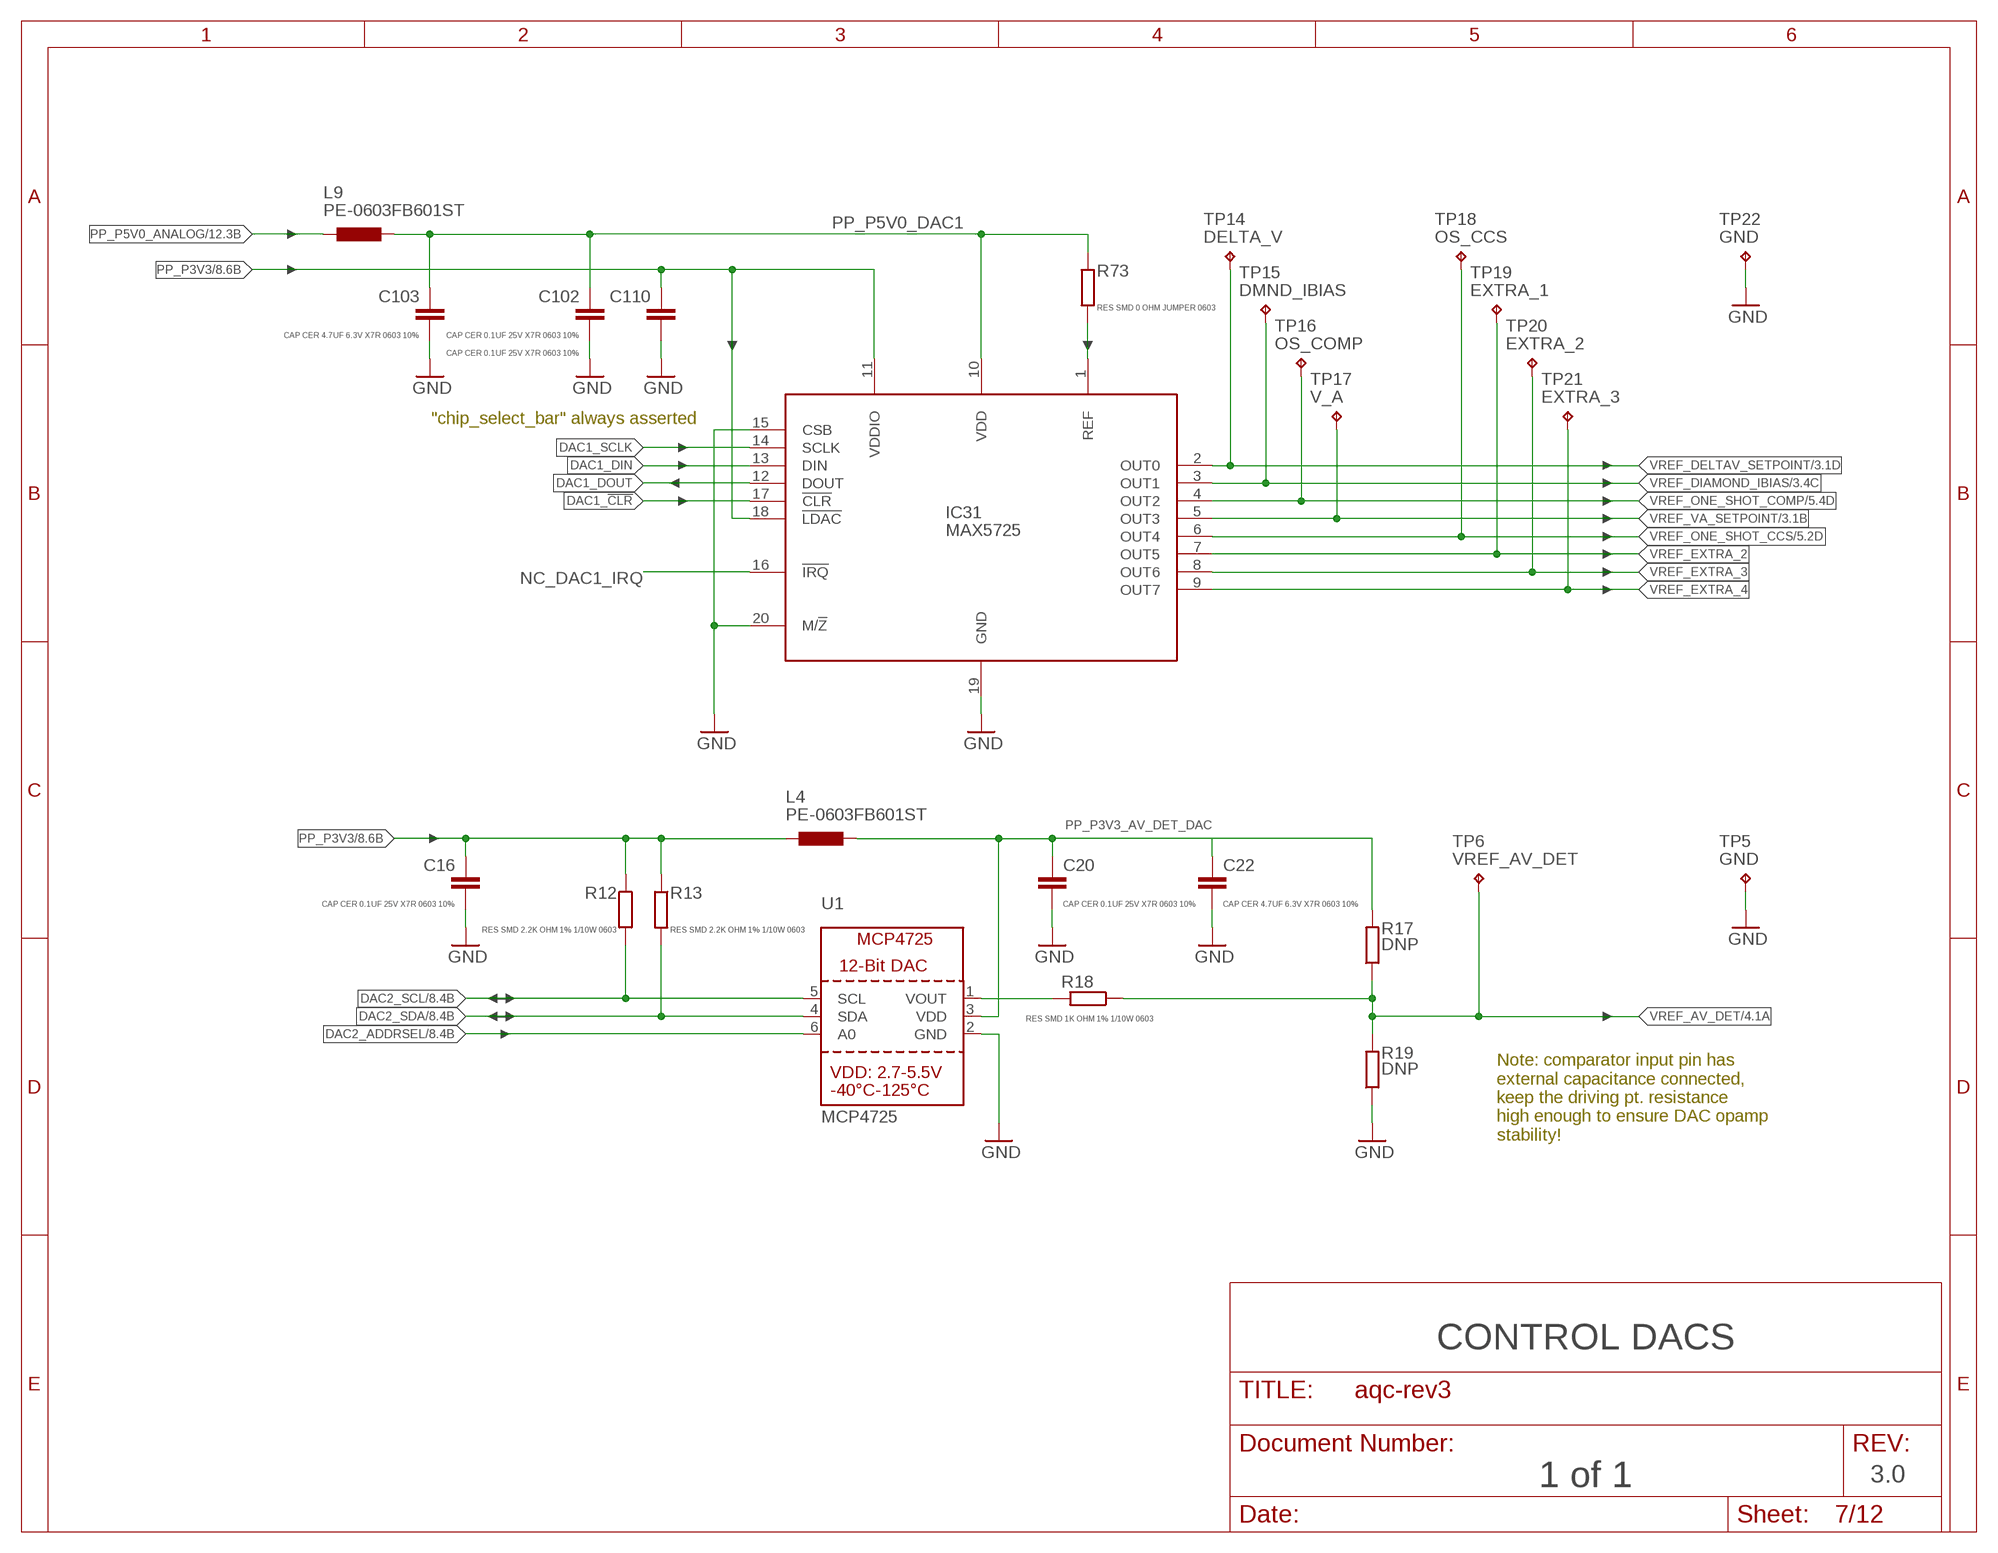
[diagram p6: schematic, sheet 7]

### Parts
C16  CAP CER 0.1UF 25V X7R 0603 10%  C-EUC0603  [C0603]
C20  CAP CER 0.1UF 25V X7R 0603 10%  C-EUC0603  [C0603]
C22  CAP CER 4.7UF 6.3V X7R 0603 10%  C-EUC0603  [C0603]
C102  CAP CER 0.1UF 25V X7R 0603 10%  C-EUC0603  [C0603]
C103  CAP CER 4.7UF 6.3V X7R 0603 10%  C-EUC0603  [C0603]
C110  CAP CER 0.1UF 25V X7R 0603 10%  C-EUC0603  [C0603]
IC31  MAX5725  MAX572X  [TSSOP20]
L4  PE-0603FB601ST  INDUCTOR0603  [R0603]
L9  PE-0603FB601ST  INDUCTOR0603  [R0603]
R12  RES SMD 2.2K OHM 1% 1/10W 0603  R-EU_R0603  [R0603]
R13  RES SMD 2.2K OHM 1% 1/10W 0603  R-EU_R0603  [R0603]
R17  DNP  R-EU_R0603  [R0603]
R18  RES SMD 1K OHM 1% 1/10W 0603  R-EU_R0603  [R0603]
R19  DNP  R-EU_R0603  [R0603]
R73  RES SMD 0 OHM JUMPER 0603  R-EU_R0603  [R0603]
TP5  GND  KEYSTONE_5000  [KEYSTONE_5000_MINIATURE]
TP6  VREF_AV_DET  KEYSTONE_5000  [KEYSTONE_5000_MINIATURE]
TP14  DELTA_V  KEYSTONE_5000  [KEYSTONE_5000_MINIATURE]
TP15  DMND_IBIAS  KEYSTONE_5000  [KEYSTONE_5000_MINIATURE]
TP16  OS_COMP  KEYSTONE_5000  [KEYSTONE_5000_MINIATURE]
TP17  V_A  KEYSTONE_5000  [KEYSTONE_5000_MINIATURE]
TP18  OS_CCS  KEYSTONE_5000  [KEYSTONE_5000_MINIATURE]
TP19  EXTRA_1  KEYSTONE_5000  [KEYSTONE_5000_MINIATURE]
TP20  EXTRA_2  KEYSTONE_5000  [KEYSTONE_5000_MINIATURE]
TP21  EXTRA_3  KEYSTONE_5000  [KEYSTONE_5000_MINIATURE]
TP22  GND  KEYSTONE_5000  [KEYSTONE_5000_MINIATURE]
U1  MCP4725  DAC_MCP4725  [SOT23-6]

### Nets
DAC1_!CLR: IC31.17(!CLR) ; also sheet 8
DAC1_DIN: IC31.13(DIN) ; also sheet 8
DAC1_DOUT: IC31.12(DOUT) ; also sheet 8
DAC1_SCLK: IC31.14(SCLK) ; also sheet 8
DAC2_ADDRSEL: U1.6(A0) ; also sheet 8
DAC2_SCL: R12.2 U1.5(SCL) ; also sheet 8
DAC2_SDA: R13.2 U1.4(SDA) ; also sheet 8
GND: C16.2 C20.2 C22.2 C102.2 C103.2 C110.2 IC31.15(CSB) IC31.19(GND) IC31.20(M/!Z) R19.1 TP5.P$1 TP22.P$1 U1.2(GND) ; also sheet 2,3,4,5,6,8,9,10,11,12
N$1: R18.2 U1.1(VOUT)
N$92: IC31.1(REF) R73.2
NC_DAC1_IRQ: IC31.16(!IRQ)
PP_P3V3: C16.1 C110.1 IC31.11(VDDIO) IC31.18(!LDAC) L4.1 R12.1 R13.1 ; also sheet 4,5,6,8,9
PP_P3V3_AV_DET_DAC: C20.1 C22.1 L4.2 R17.2 U1.3(VDD)
PP_P5V0_ANALOG: L9.1 ; also sheet 2,3,4,5,12
PP_P5V0_DAC1: C102.1 C103.1 IC31.10(VDD) L9.2 R73.1
VREF_AV_DET: R17.1 R18.1 R19.2 TP6.P$1 ; also sheet 4
VREF_DELTAV_SETPOINT: IC31.2(OUT0) TP14.P$1 ; also sheet 3
VREF_DIAMOND_IBIAS: IC31.3(OUT1) TP15.P$1 ; also sheet 3
VREF_EXTRA_2: IC31.7(OUT5) TP19.P$1
VREF_EXTRA_3: IC31.8(OUT6) TP20.P$1
VREF_EXTRA_4: IC31.9(OUT7) TP21.P$1
VREF_ONE_SHOT_CCS: IC31.6(OUT4) TP18.P$1 ; also sheet 5
VREF_ONE_SHOT_COMP: IC31.4(OUT2) TP16.P$1 ; also sheet 5
VREF_VA_SETPOINT: IC31.5(OUT3) TP17.P$1 ; also sheet 3

### Notes on the sheet
- "chip_select_bar" always asserted
- Note: comparator input pin has
  external capacitance connected,
  keep the driving pt. resistance
  high enough to ensure DAC opamp
  stability!
- CONTROL DACS
- 1 of 1 | 3.0

## Sheet 8 of 12
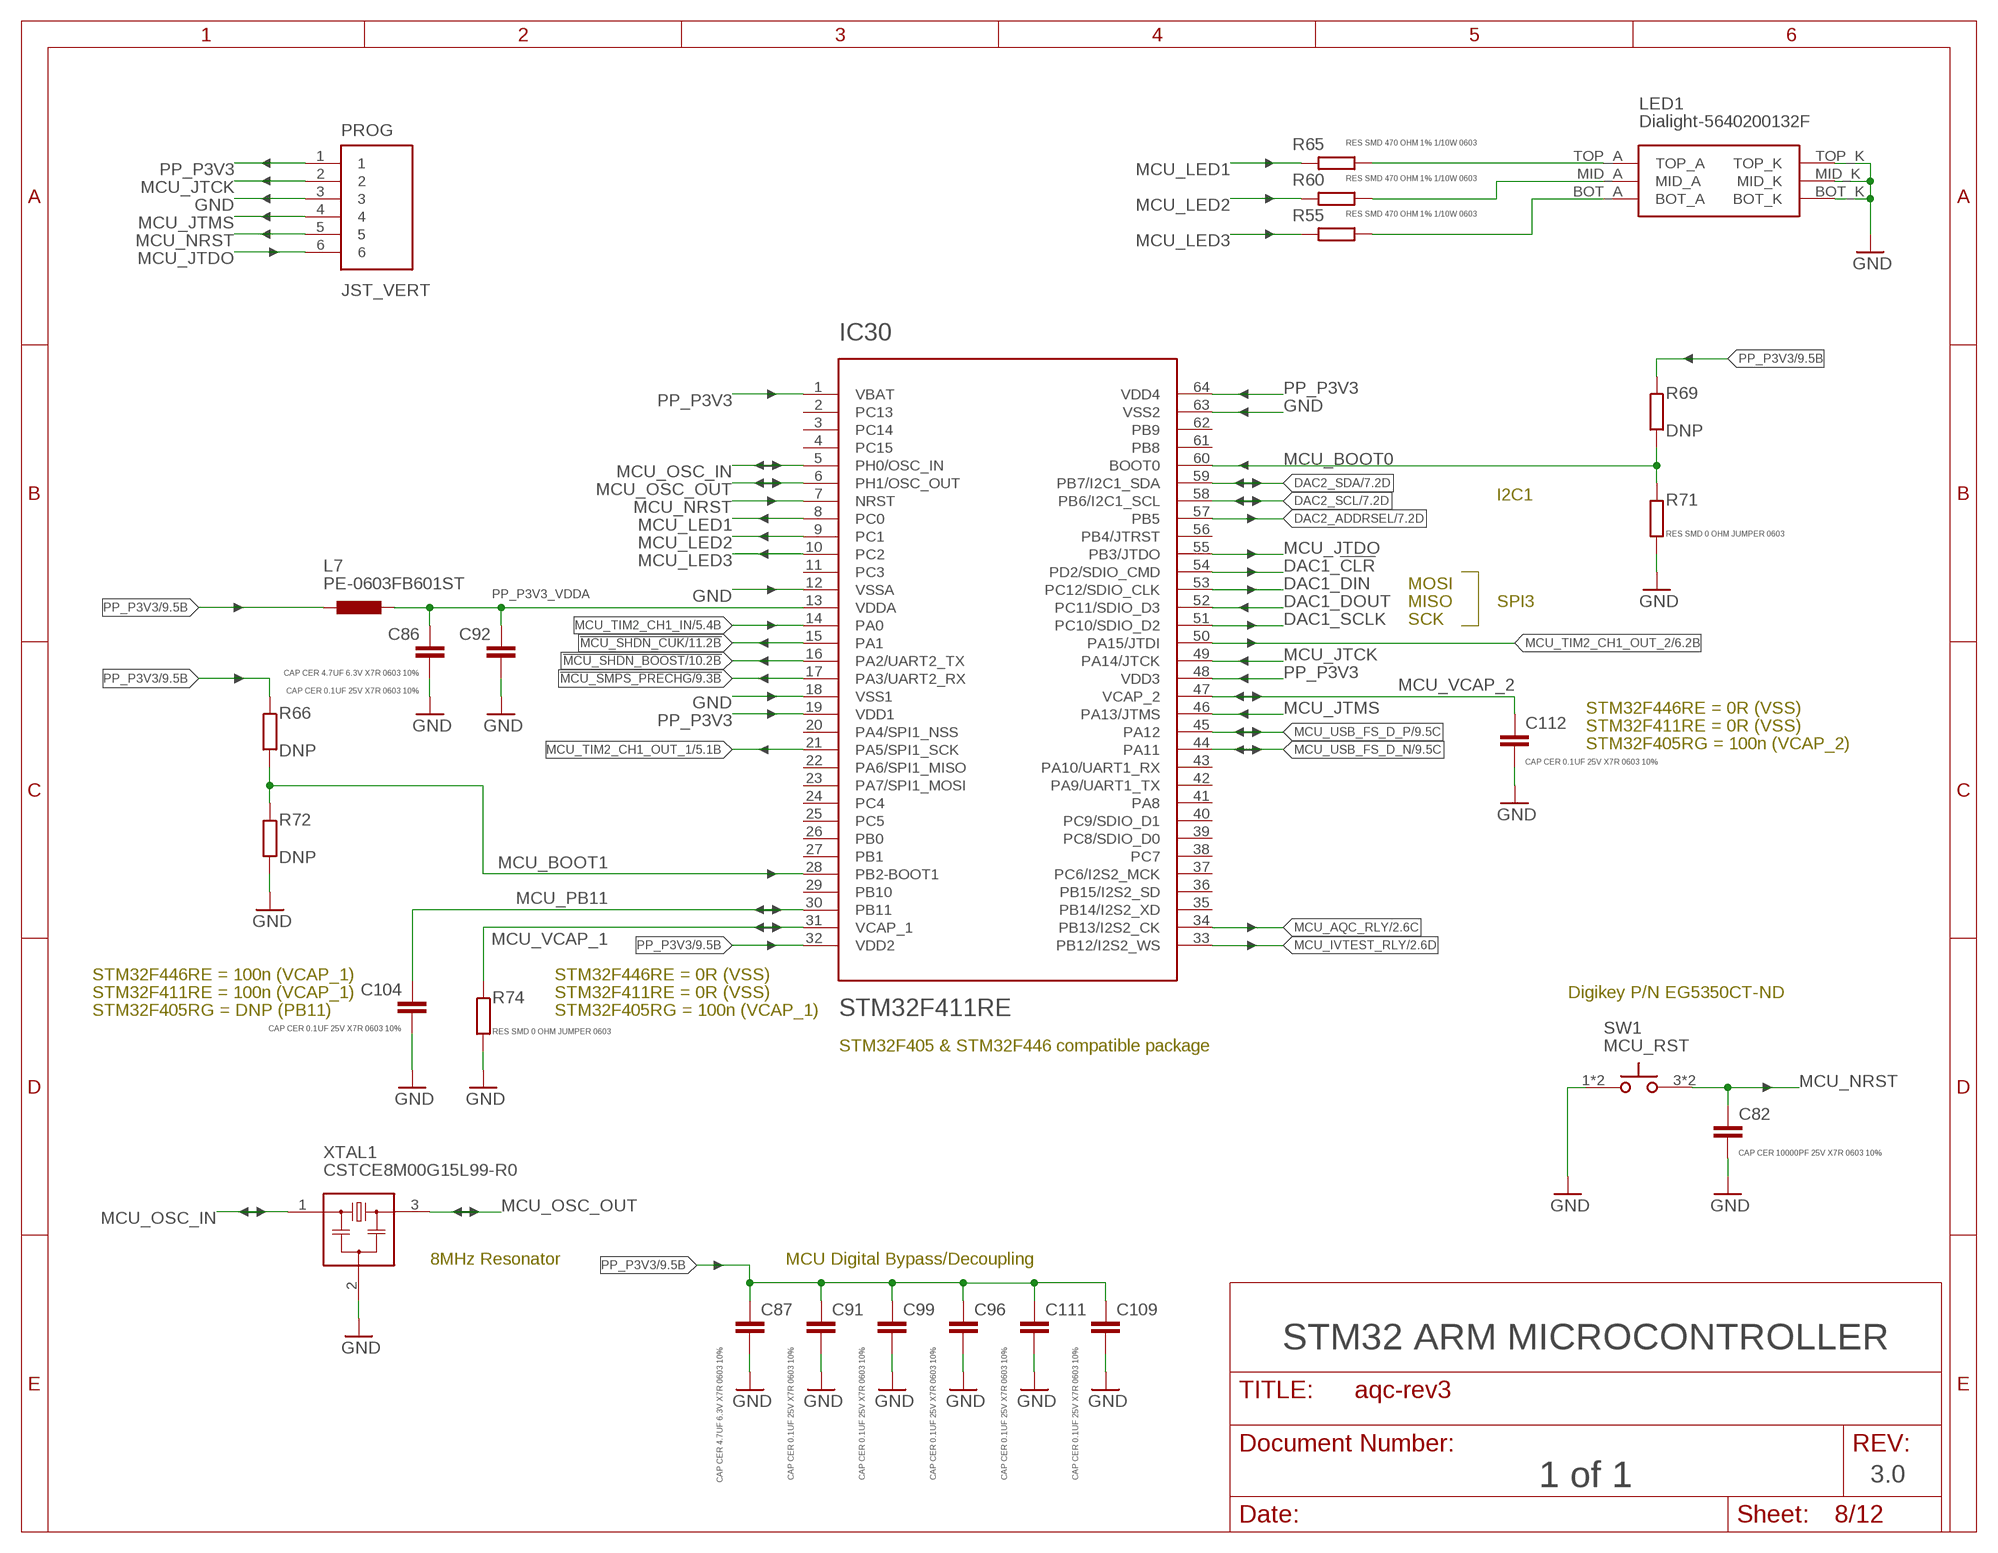
[diagram p7: schematic, sheet 8]

### Parts
C82  CAP CER 10000PF 25V X7R 0603 10%  C-EUC0603  [C0603]
C86  CAP CER 4.7UF 6.3V X7R 0603 10%  C-EUC0603  [C0603]
C87  CAP CER 4.7UF 6.3V X7R 0603 10%  C-EUC0603  [C0603]
C91  CAP CER 0.1UF 25V X7R 0603 10%  C-EUC0603  [C0603]
C92  CAP CER 0.1UF 25V X7R 0603 10%  C-EUC0603  [C0603]
C96  CAP CER 0.1UF 25V X7R 0603 10%  C-EUC0603  [C0603]
C99  CAP CER 0.1UF 25V X7R 0603 10%  C-EUC0603  [C0603]
C104  CAP CER 0.1UF 25V X7R 0603 10%  C-EUC0603  [C0603]
C109  CAP CER 0.1UF 25V X7R 0603 10%  C-EUC0603  [C0603]
C111  CAP CER 0.1UF 25V X7R 0603 10%  C-EUC0603  [C0603]
C112  CAP CER 0.1UF 25V X7R 0603 10%  C-EUC0603  [C0603]
IC30  STM32F411RE  STM32F405RG  [TQFP64_STM32]
L7  PE-0603FB601ST  INDUCTOR0603  [R0603]
LED1  Dialight-5640200132F  CBI-564-0X00-XXX-3LED  [CBI-564-0X00-XXX]
PROG  JST_VERT  JST_VERTICAL  [JST-6-SMD-VERT-1.0MM]
R55  RES SMD 470 OHM 1% 1/10W 0603  R-EU_R0603  [R0603]
R60  RES SMD 470 OHM 1% 1/10W 0603  R-EU_R0603  [R0603]
R65  RES SMD 470 OHM 1% 1/10W 0603  R-EU_R0603  [R0603]
R66  DNP  R-EU_R0603  [R0603]
R69  DNP  R-EU_R0603  [R0603]
R71  RES SMD 0 OHM JUMPER 0603  R-EU_R0603  [R0603]
R72  DNP  R-EU_R0603  [R0603]
R74  RES SMD 0 OHM JUMPER 0603  R-EU_R0603  [R0603]
SW1  MCU_RST  E-SWITCH-TL3305AF160QG  [E-SWITCH-TL3305AF160QG]
XTAL1  CSTCE8M00G15L99-R0  MURATA_CSTCE_G15L/CSTCE_GH5L  [CSTCE_G15L/CSTCE_GH5L]

### Nets
!MCU_SHDN_BOOST: IC30.16(PA2/UART2_TX) ; also sheet 10
!MCU_SHDN_CUK: IC30.15(PA1) ; also sheet 11
!MCU_SMPS_PRECHG: IC30.17(PA3/UART2_RX) ; also sheet 9
DAC1_!CLR: IC30.54(PD2/SDIO_CMD) ; also sheet 7
DAC1_DIN: IC30.53(PC12/SDIO_CLK) ; also sheet 7
DAC1_DOUT: IC30.52(PC11/SDIO_D3) ; also sheet 7
DAC1_SCLK: IC30.51(PC10/SDIO_D2) ; also sheet 7
DAC2_ADDRSEL: IC30.57(PB5) ; also sheet 7
DAC2_SCL: IC30.58(PB6/I2C1_SCL) ; also sheet 7
DAC2_SDA: IC30.59(PB7/I2C1_SDA) ; also sheet 7
GND: C82.2 C86.2 C87.2 C91.2 C92.2 C96.2 C99.2 C104.2 C109.2 C111.2 C112.2 IC30.12(VSSA) IC30.18(VSS1) IC30.63(VSS2) LED1.BOT_K LED1.MID_K LED1.TOP_K PROG.3 R71.2 R72.2 R74.2 SW1.1 SW1.2 XTAL1.2(GND) ; also sheet 2,3,4,5,6,7,9,10,11,12
MCU_AQC_RLY: IC30.34(PB13/I2S2_CK) ; also sheet 2
MCU_BOOT0: IC30.60(BOOT0) R69.2 R71.1
MCU_BOOT1: IC30.28(PB2-BOOT1) R66.2 R72.1
MCU_IVTEST_RLY: IC30.33(PB12/I2S2_WS) ; also sheet 2
MCU_JTCK: IC30.49(PA14/JTCK) PROG.2
MCU_JTDO: IC30.55(PB3/JTDO) PROG.6
MCU_JTMS: IC30.46(PA13/JTMS) PROG.4
MCU_LED1: IC30.8(PC0) R65.2
MCU_LED2: IC30.9(PC1) R60.2
MCU_LED3: IC30.10(PC2) R55.2
MCU_NRST: C82.1 IC30.7(NRST) PROG.5 SW1.3 SW1.4
MCU_OSC_IN: IC30.5(PH0/OSC_IN) XTAL1.1(LEFT)
MCU_OSC_OUT: IC30.6(PH1/OSC_OUT) XTAL1.3(RIGHT)
MCU_PB11: C104.1 IC30.30(PB11)
MCU_TIM2_CH1_IN: IC30.14(PA0) ; also sheet 5
MCU_TIM2_CH1_OUT_1: IC30.21(PA5/SPI1_SCK) ; also sheet 5
MCU_TIM2_CH1_OUT_2: IC30.50(PA15/JTDI) ; also sheet 6
MCU_USB_FS_D_N [100OHM_DIFF]: IC30.44(PA11) ; also sheet 9
MCU_USB_FS_D_P [100OHM_DIFF]: IC30.45(PA12) ; also sheet 9
MCU_VCAP_1: IC30.31(VCAP_1) R74.1
MCU_VCAP_2: C112.1 IC30.47(VCAP_2)
N$9: LED1.TOP_A R65.1
N$24: LED1.MID_A R60.1
N$31: LED1.BOT_A R55.1
PP_P3V3: C87.1 C91.1 C96.1 C99.1 C109.1 C111.1 IC30.1(VBAT) IC30.19(VDD1) IC30.32(VDD2) IC30.48(VDD3) IC30.64(VDD4) L7.1 PROG.1 R66.1 R69.1 ; also sheet 4,5,6,7,9
PP_P3V3_VDDA: C86.1 C92.1 IC30.13(VDDA) L7.2
Unconnected: IC30.2(PC13) IC30.3(PC14) IC30.4(PC15) IC30.11(PC3) IC30.20(PA4/SPI1_NSS) IC30.22(PA6/SPI1_MISO) IC30.23(PA7/SPI1_MOSI) IC30.24(PC4) IC30.25(PC5) IC30.26(PB0) IC30.27(PB1) IC30.29(PB10) IC30.35(PB14/I2S2_XD) IC30.36(PB15/I2S2_SD) IC30.37(PC6/I2S2_MCK) IC30.38(PC7) IC30.39(PC8/SDIO_D0) IC30.40(PC9/SDIO_D1) IC30.41(PA8) IC30.42(PA9/UART1_TX) IC30.43(PA10/UART1_RX) IC30.56(PB4/JTRST) IC30.61(PB8) IC30.62(PB9)

### Notes on the sheet
- I2C1
- MOSI
- MISO | SPI3
- SCK
- STM32F446RE = 0R (VSS)
- STM32F411RE = 0R (VSS)
- STM32F405RG = 100n (VCAP_2)
- STM32F446RE = 100n (VCAP_1) | STM32F446RE = 0R (VSS)
- STM32F411RE = 100n (VCAP_1) | STM32F411RE = 0R (VSS) | Digikey P/N EG5350CT-ND
- STM32F405RG = DNP (PB11) | STM32F405RG = 100n (VCAP_1)
- STM32F405 & STM32F446 compatible package
- 8MHz Resonator | MCU Digital Bypass/Decoupling
- STM32 ARM MICROCONTROLLER
- 1 of 1 | 3.0

## Sheet 9 of 12
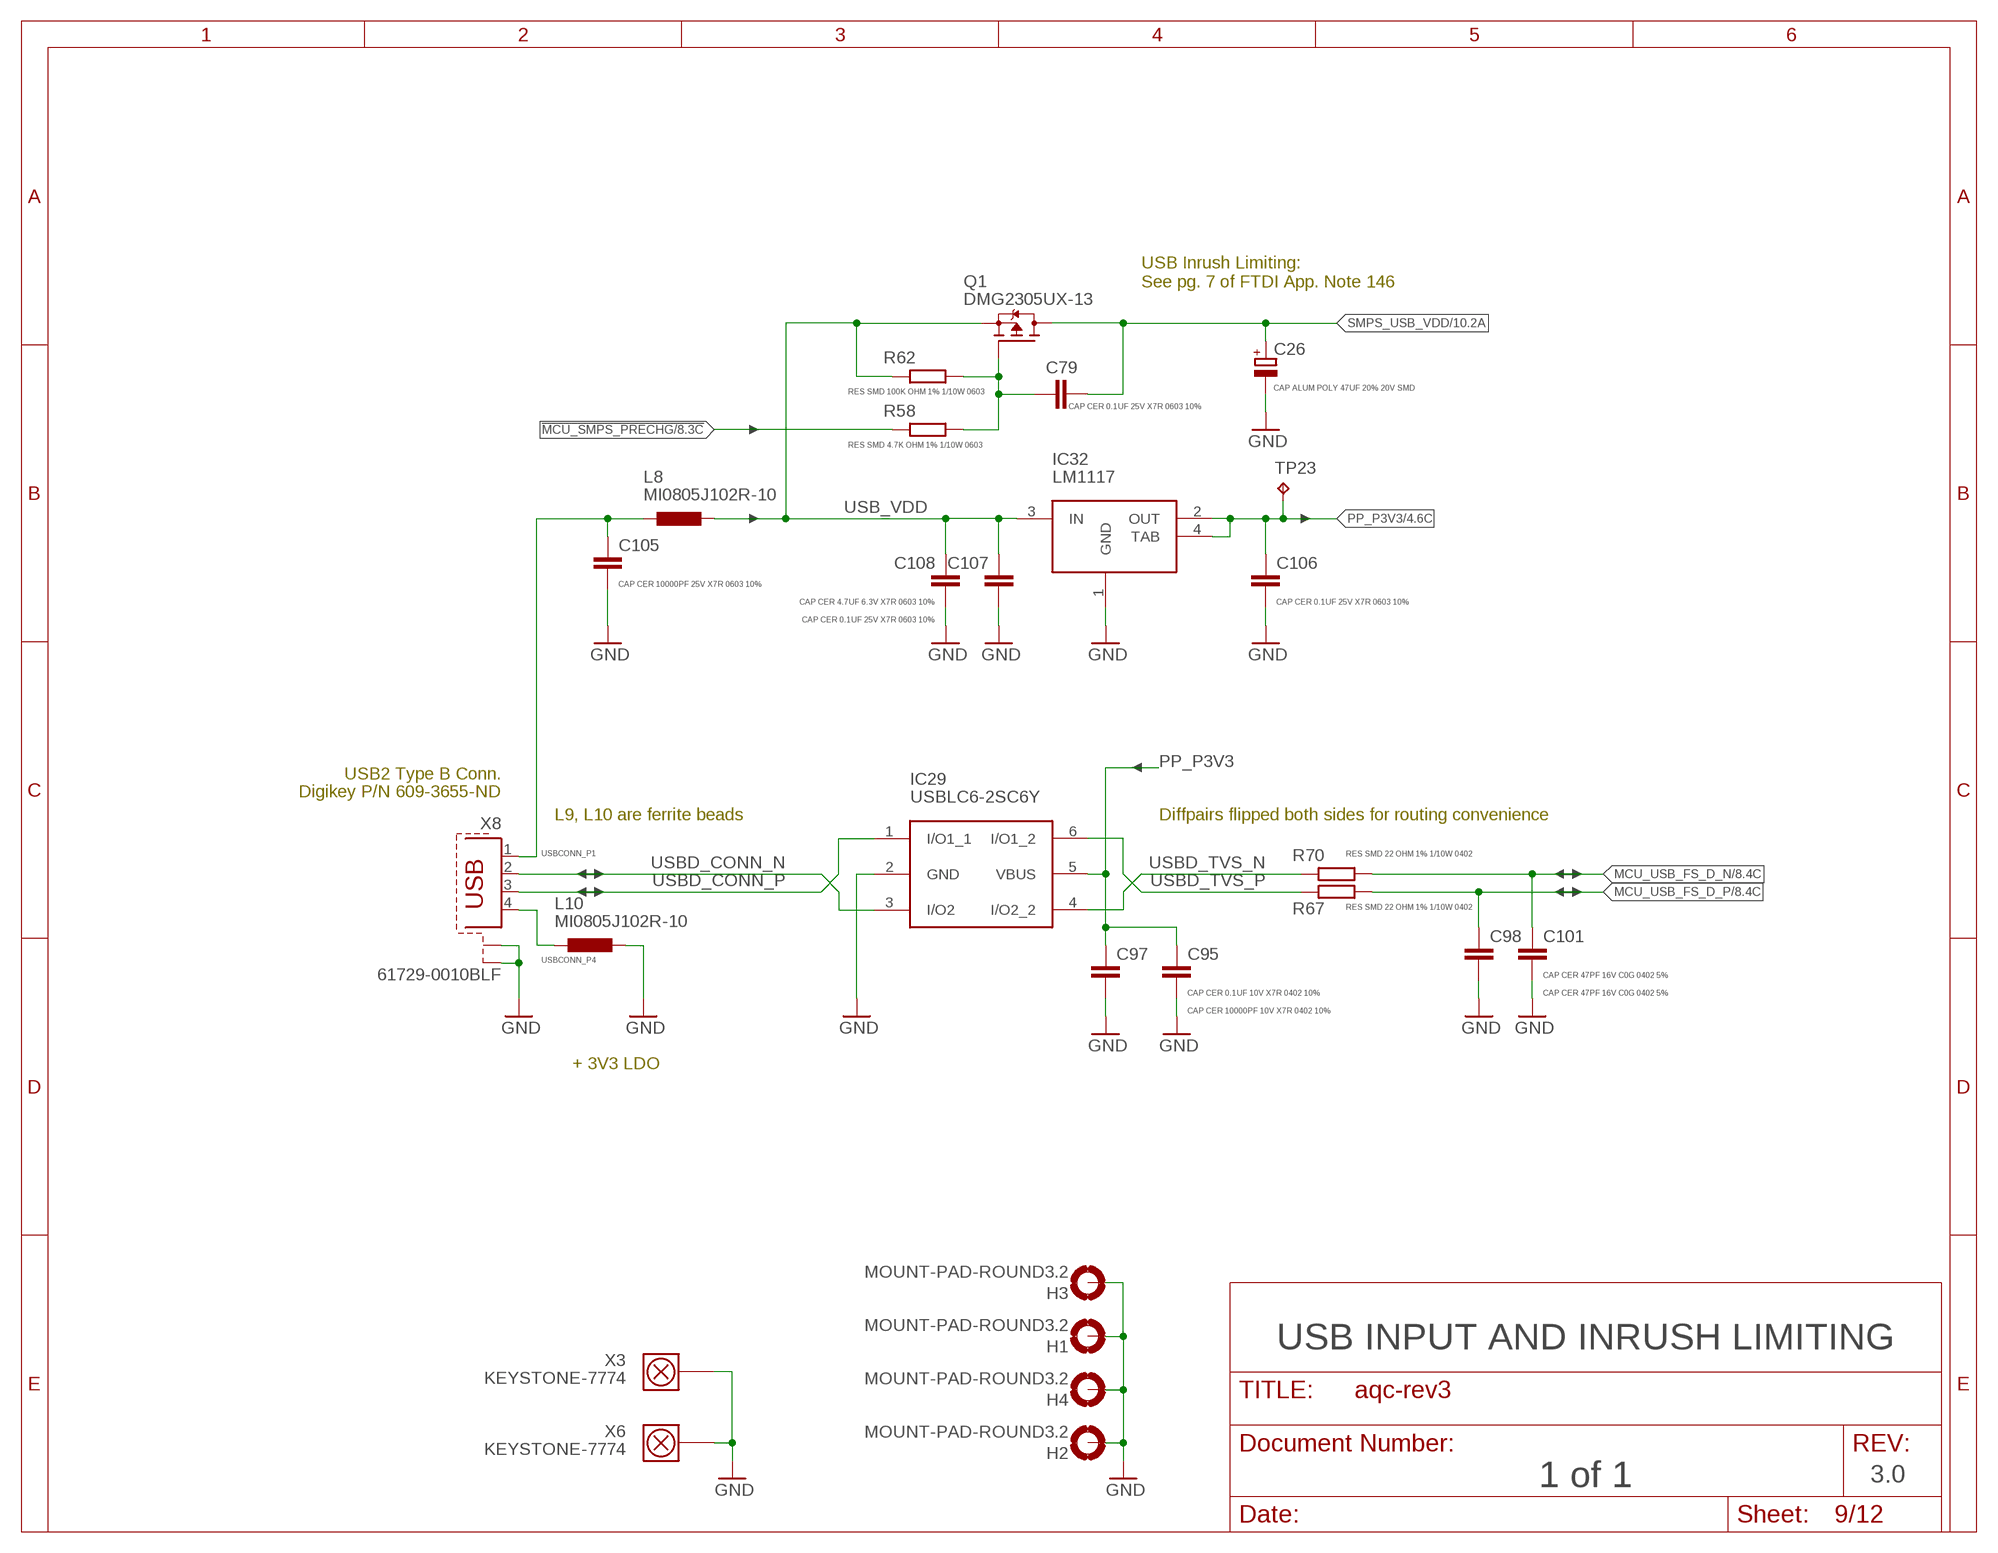
[diagram p8: schematic, sheet 9]

### Parts
C26  CAP ALUM POLY 47UF 20% 20V SMD  CPOL-EUCT7343  [CT7343]
C79  CAP CER 0.1UF 25V X7R 0603 10%  C-EUC0603  [C0603]
C95  CAP CER 0.1UF 10V X7R 0402 10%  C-EUC0402  [C0402]
C97  CAP CER 10000PF 10V X7R 0402 10%  C-EUC0402  [C0402]
C98  CAP CER 47PF 16V C0G 0402 5%  C-EUC0402  [C0402]
C101  CAP CER 47PF 16V C0G 0402 5%  C-EUC0402  [C0402]
C105  CAP CER 10000PF 25V X7R 0603 10%  C-EUC0603  [C0603]
C106  CAP CER 0.1UF 25V X7R 0603 10%  C-EUC0603  [C0603]
C107  CAP CER 0.1UF 25V X7R 0603 10%  C-EUC0603  [C0603]
C108  CAP CER 4.7UF 6.3V X7R 0603 10%  C-EUC0603  [C0603]
H1  MOUNT-PAD-ROUND3.2  [3,2-PAD]
H2  MOUNT-PAD-ROUND3.2  [3,2-PAD]
H3  MOUNT-PAD-ROUND3.2  [3,2-PAD]
H4  MOUNT-PAD-ROUND3.2  [3,2-PAD]
IC29  USBLC6-2SC6Y  USBLC6  [SOT23-6L]
IC32  LM1117  [SOT-223]
L8  MI0805J102R-10  INDUCTOR0805  [R0805]
L10  MI0805J102R-10  INDUCTOR0805  [R0805]
Q1  DMG2305UX-13  MOSFET-PWIDE  [SOT23-WIDE]
R58  RES SMD 4.7K OHM 1% 1/10W 0603  R-EU_R0603  [R0603]
R62  RES SMD 100K OHM 1% 1/10W 0603  R-EU_R0603  [R0603]
R67  RES SMD 22 OHM 1% 1/10W 0402  R-EU_R0402  [R0402]
R70  RES SMD 22 OHM 1% 1/10W 0402  R-EU_R0402  [R0402]
TP23  TPTP15R  [TP15R]
X3  KEYSTONE-7774  [KEYSTONE-7774]
X6  KEYSTONE-7774  [KEYSTONE-7774]
X8  61729-0010BLF  PN61729-S  [PN61729-S]

### Nets
!MCU_SMPS_PRECHG: R58.2 ; also sheet 8
GND: C26.- C95.2 C97.2 C98.2 C101.2 C105.2 C106.2 C107.2 C108.2 H1.B3,2(MOUNT) H2.B3,2(MOUNT) H3.B3,2(MOUNT) H4.B3,2(MOUNT) IC29.2(GND) IC32.1(GND) L10.2 X3.1 X3.2 X3.3 X3.4 X6.1 X6.2 X6.3 X6.4 X8.S1 X8.S2 ; also sheet 2,3,4,5,6,7,8,10,11,12
MCU_USB_FS_D_N [100OHM_DIFF]: C101.1 R70.1 ; also sheet 8
MCU_USB_FS_D_P [100OHM_DIFF]: C98.1 R67.1 ; also sheet 8
N$12: C79.1 Q1.1(G) R58.1 R62.1
PP_P3V3: C95.1 C97.1 C106.1 IC29.5(VBUS) IC32.2(OUT) IC32.4(TAB) TP23.TP ; also sheet 4,5,6,7,8
SMPS_USB_VDD: C26.+ C79.2 Q1.3(D) ; also sheet 2,10,11
USB_VDD: C107.1 C108.1 IC32.3(IN) L8.2 Q1.2(S) R62.2
USBCONN_P1: C105.1 L8.1 X8.1
USBCONN_P4: L10.1 X8.4
USBD_CONN_N [100OHM_DIFF]: IC29.3(I/O2) X8.2
USBD_CONN_P [100OHM_DIFF]: IC29.1(I/O1_1) X8.3
USBD_TVS_N [100OHM_DIFF]: IC29.4(I/O2_2) R70.2
USBD_TVS_P [100OHM_DIFF]: IC29.6(I/O1_2) R67.2

### Notes on the sheet
- USB Inrush Limiting:
  See pg. 7 of FTDI App. Note 146
- USB2 Type B Conn.
- Digikey P/N 609-3655-ND
- L9, L10 are ferrite beads | Diffpairs flipped both sides for routing convenience
- + 3V3 LDO
- USB INPUT AND INRUSH LIMITING
- 1 of 1 | 3.0

## Sheet 10 of 12
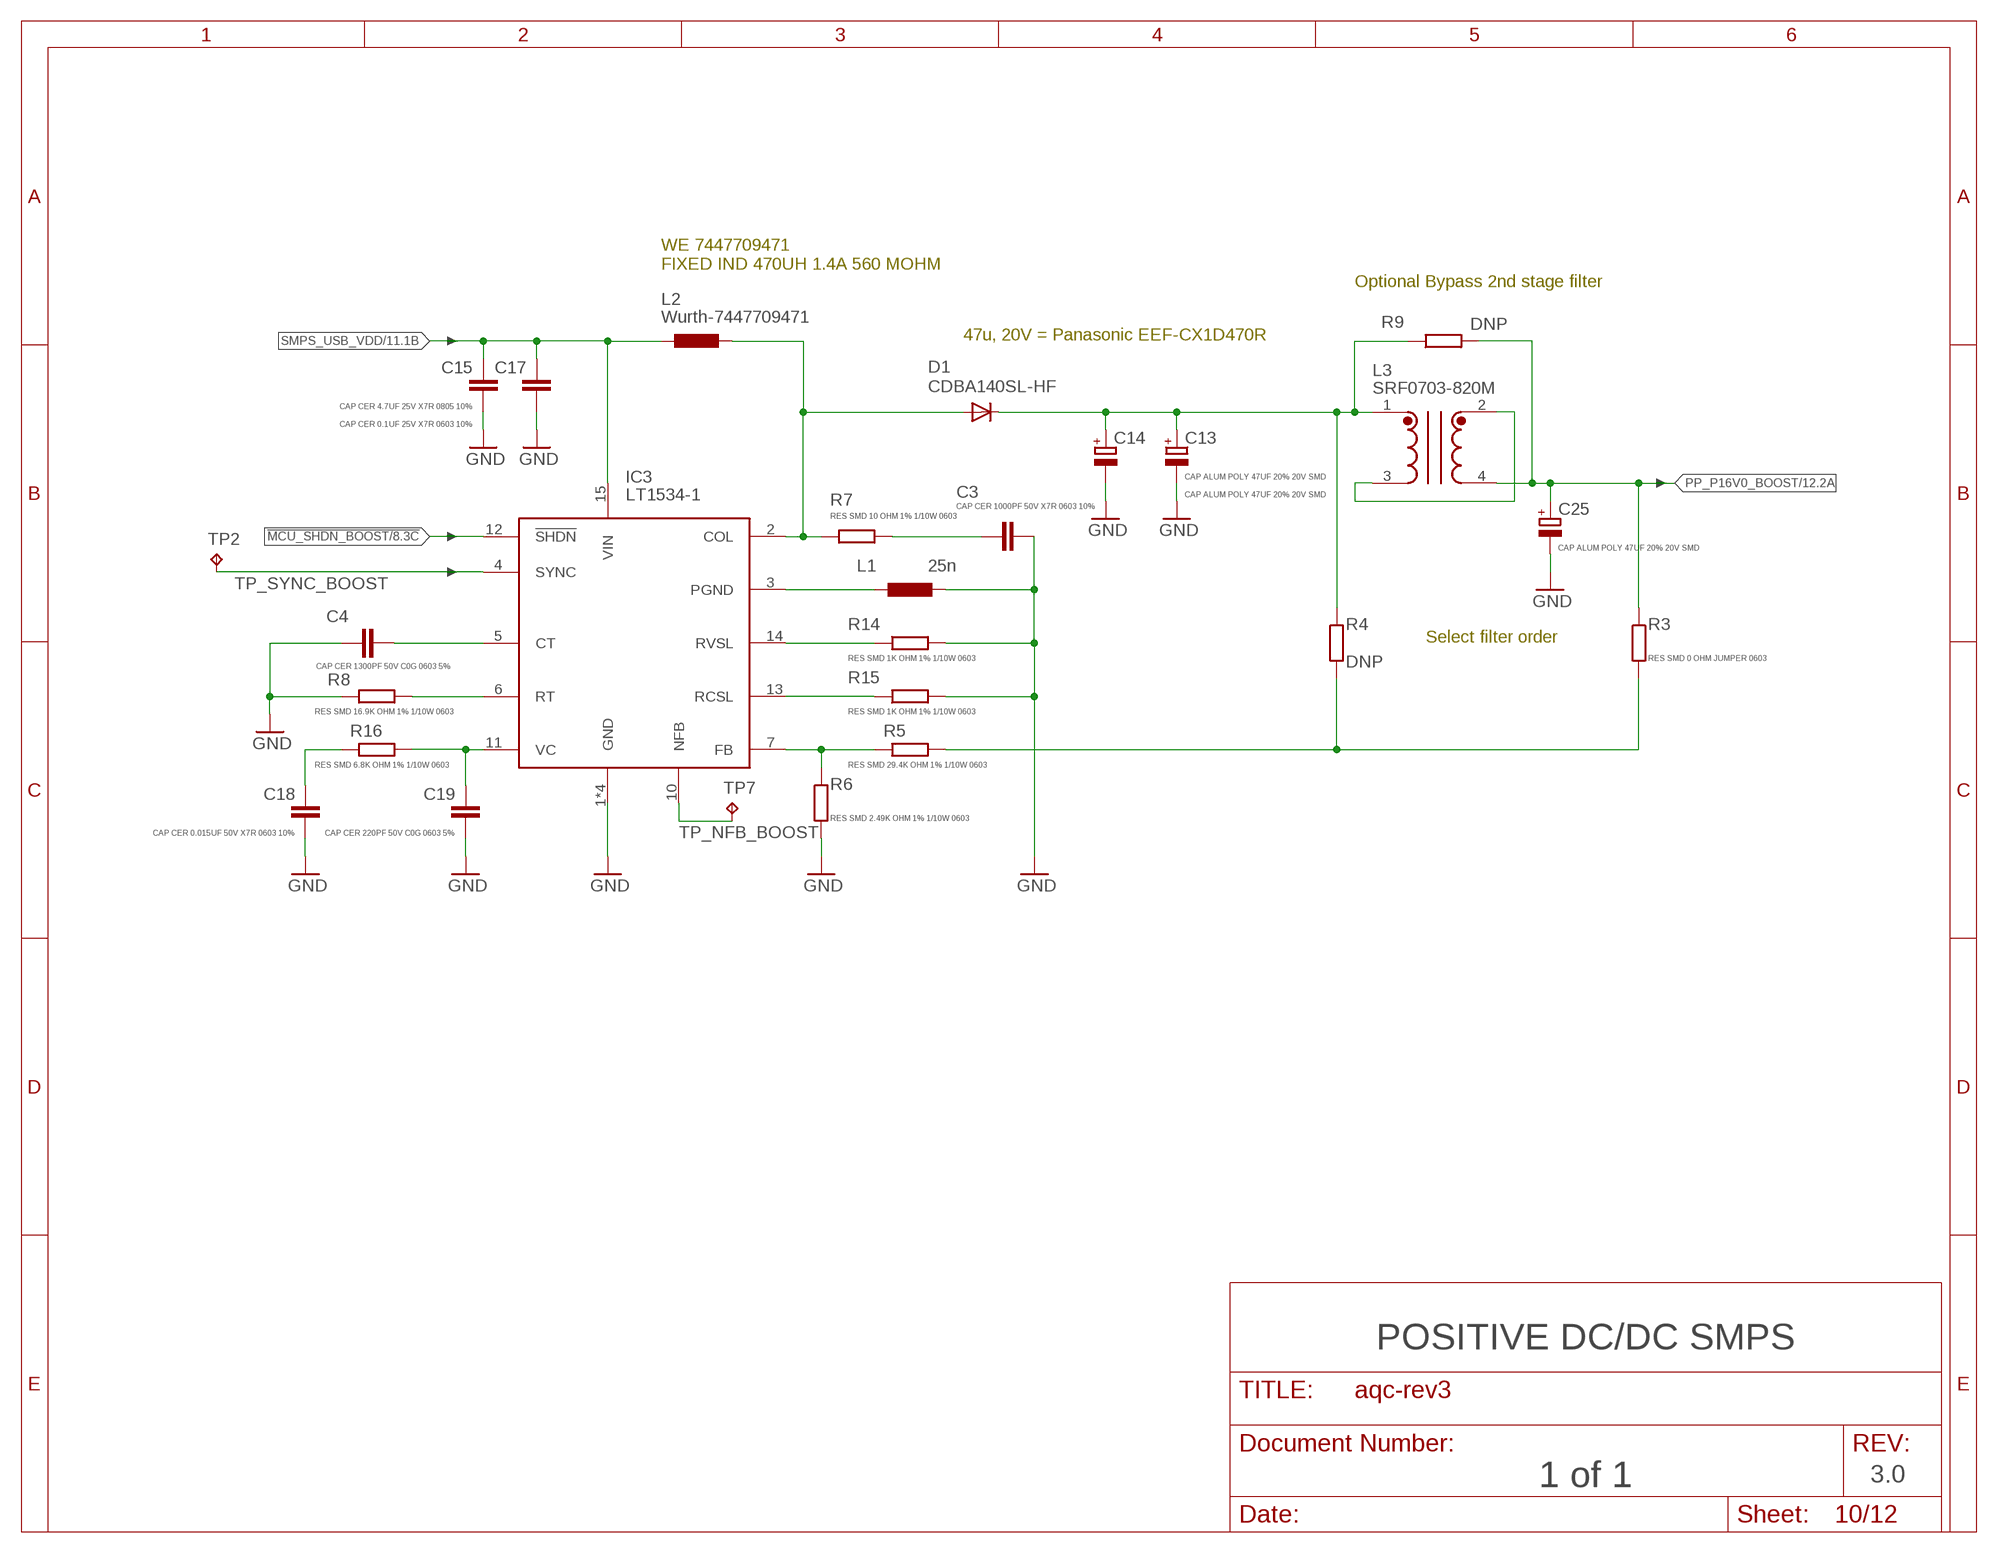
[diagram p9: schematic, sheet 10]

### Parts
C3  CAP CER 1000PF 50V X7R 0603 10%  C-EUC0603  [C0603]
C4  CAP CER 1300PF 50V C0G 0603 5%  C-EUC0603  [C0603]
C13  CAP ALUM POLY 47UF 20% 20V SMD  CPOL-EUCT7343  [CT7343]
C14  CAP ALUM POLY 47UF 20% 20V SMD  CPOL-EUCT7343  [CT7343]
C15  CAP CER 4.7UF 25V X7R 0805 10%  C-EUC0805  [C0805]
C17  CAP CER 0.1UF 25V X7R 0603 10%  C-EUC0603  [C0603]
C18  CAP CER 0.015UF 50V X7R 0603 10%  C-EUC0603  [C0603]
C19  CAP CER 220PF 50V C0G 0603 5%  C-EUC0603  [C0603]
C25  CAP ALUM POLY 47UF 20% 20V SMD  CPOL-EUCT7343  [CT7343]
D1  CDBA140SL-HF  DIODE-DO214AC  [DO214AC]
IC3  LT1534-1  LT1534  [SO16]
L1  25n  INDUCTOR0603  [R0603]
L2  Wurth-7447709471  WE_INDUCTOR  [WE_INDUCTOR_SIZE_CODE_1210]
L3  SRF0703-820M  SRF0703  [SRF0703]
R3  RES SMD 0 OHM JUMPER 0603  R-EU_R0603  [R0603]
R4  DNP  R-EU_R0603  [R0603]
R5  RES SMD 29.4K OHM 1% 1/10W 0603  R-EU_R0603  [R0603]
R6  RES SMD 2.49K OHM 1% 1/10W 0603  R-EU_R0603  [R0603]
R7  RES SMD 10 OHM 1% 1/10W 0603  R-EU_R0603  [R0603]
R8  RES SMD 16.9K OHM 1% 1/10W 0603  R-EU_R0603  [R0603]
R9  DNP  R-EU_R0603  [R0603]
R14  RES SMD 1K OHM 1% 1/10W 0603  R-EU_R0603  [R0603]
R15  RES SMD 1K OHM 1% 1/10W 0603  R-EU_R0603  [R0603]
R16  RES SMD 6.8K OHM 1% 1/10W 0603  R-EU_R0603  [R0603]
TP2  TPB1,27  [B1,27]
TP7  TPB1,27  [B1,27]

### Nets
!MCU_SHDN_BOOST: IC3.12(!SHDN) ; also sheet 8
BOOST_STAGE1: C13.+ C14.+ D1.C L3.1 R4.1 R9.1
BOOST_SW_NODE: D1.A IC3.2(COL) L2.2 R7.1
GND: C3.1 C4.2 C13.- C14.- C15.2 C17.2 C18.2 C19.2 C25.- IC3.1(GND) IC3.8(GND) IC3.9(GND) IC3.16(GND) L1.2 R6.2 R8.1 R14.2 R15.2 ; also sheet 2,3,4,5,6,7,8,9,11,12
LBOOST_2: L3.2 L3.3
N$18: IC3.7(FB) R5.1 R6.1
N$19: IC3.3(PGND) L1.1
N$39: C4.1 IC3.5(CT)
N$51: IC3.13(RCSL) R15.1
N$52: IC3.14(RVSL) R14.1
N$54: C3.2 R7.2
N$55: C18.1 R16.1
N$56: C19.1 IC3.11(VC) R16.2
N$57: IC3.6(RT) R8.2
N$73: R3.2 R4.2 R5.2
PP_P16V0_BOOST: C25.+ L3.4 R3.1 R9.2 ; also sheet 12
SMPS_USB_VDD: C15.1 C17.1 IC3.15(VIN) L2.1 ; also sheet 2,9,11
TP_NFB_BOOST: IC3.10(NFB) TP7.TP
TP_SYNC_BOOST: IC3.4(SYNC) TP2.TP

### Notes on the sheet
- WE 7447709471
  FIXED IND 470UH 1.4A 560 MOHM
- Optional Bypass 2nd stage filter
- 47u, 20V = Panasonic EEF-CX1D470R
- Select filter order
- POSITIVE DC/DC SMPS
- 1 of 1 | 3.0

## Sheet 11 of 12
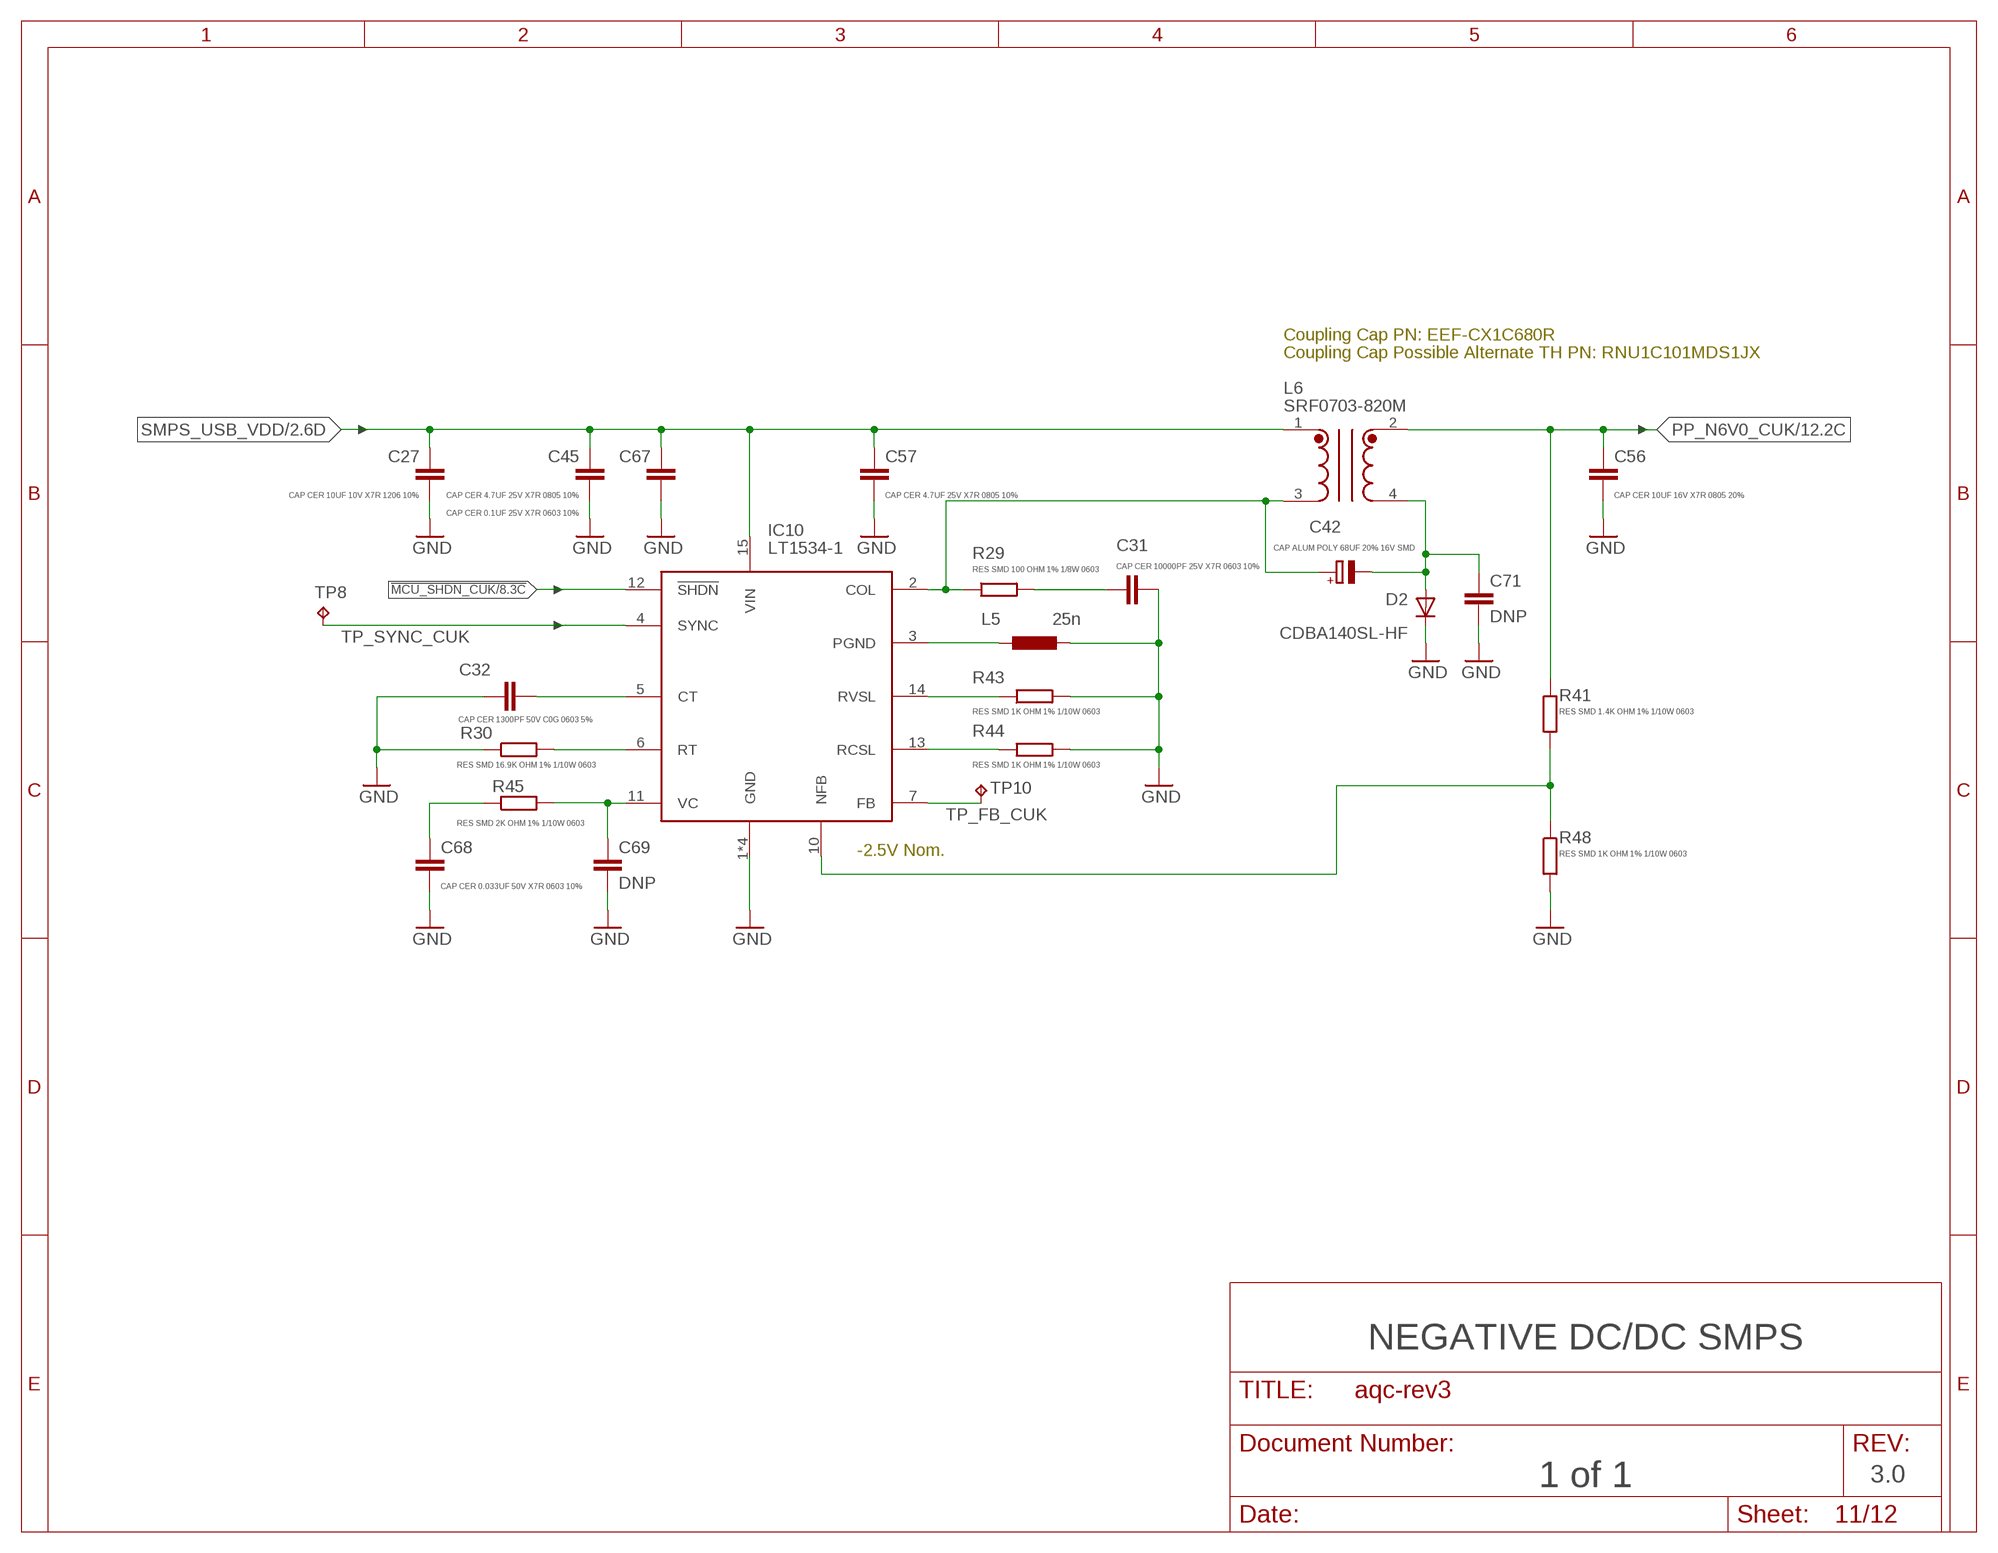
[diagram p10: schematic, sheet 11]

### Parts
C27  CAP CER 10UF 10V X7R 1206 10%  C-EUC1206  [C1206]
C31  CAP CER 10000PF 25V X7R 0603 10%  C-EUC0603  [C0603]
C32  CAP CER 1300PF 50V C0G 0603 5%  C-EUC0603  [C0603]
C42  CAP ALUM POLY 68UF 20% 16V SMD  CPOL-EUCT7343  [CT7343]
C45  CAP CER 4.7UF 25V X7R 0805 10%  C-EUC0805  [C0805]
C56  CAP CER 10UF 16V X7R 0805 20%  C-EUC0805  [C0805]
C57  CAP CER 4.7UF 25V X7R 0805 10%  C-EUC0805  [C0805]
C67  CAP CER 0.1UF 25V X7R 0603 10%  C-EUC0603  [C0603]
C68  CAP CER 0.033UF 50V X7R 0603 10%  C-EUC0603  [C0603]
C69  DNP  C-EUC0603  [C0603]
C71  DNP  C-EUC0603  [C0603]
D2  CDBA140SL-HF  DIODE-DO214AC  [DO214AC]
IC10  LT1534-1  LT1534  [SO16]
L5  25n  INDUCTOR0603  [R0603]
L6  SRF0703-820M  SRF0703  [SRF0703]
R29  RES SMD 100 OHM 1% 1/8W 0603  R-EU_R0603  [R0603]
R30  RES SMD 16.9K OHM 1% 1/10W 0603  R-EU_R0603  [R0603]
R41  RES SMD 1.4K OHM 1% 1/10W 0603  R-EU_R0603  [R0603]
R43  RES SMD 1K OHM 1% 1/10W 0603  R-EU_R0603  [R0603]
R44  RES SMD 1K OHM 1% 1/10W 0603  R-EU_R0603  [R0603]
R45  RES SMD 2K OHM 1% 1/10W 0603  R-EU_R0603  [R0603]
R48  RES SMD 1K OHM 1% 1/10W 0603  R-EU_R0603  [R0603]
TP8  TPB1,27  [B1,27]
TP10  TPB1,27  [B1,27]

### Nets
!MCU_SHDN_CUK: IC10.12(!SHDN) ; also sheet 8
GND: C27.2 C31.2 C32.2 C45.2 C56.2 C57.2 C67.2 C68.2 C69.2 C71.2 D2.C IC10.1(GND) IC10.8(GND) IC10.9(GND) IC10.16(GND) L5.2 R30.1 R43.2 R44.2 R48.2 ; also sheet 2,3,4,5,6,7,8,9,10,12
N$8: C32.1 IC10.5(CT)
N$20: IC10.3(PGND) L5.1
N$60: IC10.13(RCSL) R44.1
N$61: IC10.14(RVSL) R43.1
N$62: C31.1 R29.2
N$63: C68.1 R45.1
N$64: C69.1 IC10.11(VC) R45.2
N$65: IC10.6(RT) R30.2
N$67: IC10.10(NFB) R41.2 R48.1
N$68: C42.+ IC10.2(COL) L6.3 R29.1
N$69: C42.- C71.1 D2.A L6.4
PP_N6V0_CUK: C56.1 L6.2 R41.1 ; also sheet 12
SMPS_USB_VDD: C27.1 C45.1 C57.1 C67.1 IC10.15(VIN) L6.1 ; also sheet 2,9,10
TP_FB_CUK: IC10.7(FB) TP10.TP
TP_SYNC_CUK: IC10.4(SYNC) TP8.TP

### Notes on the sheet
- Coupling Cap PN: EEF-CX1C680R
- Coupling Cap Possible Alternate TH PN: RNU1C101MDS1JX
- -2.5V Nom.
- NEGATIVE DC/DC SMPS
- 1 of 1 | 3.0

## Sheet 12 of 12
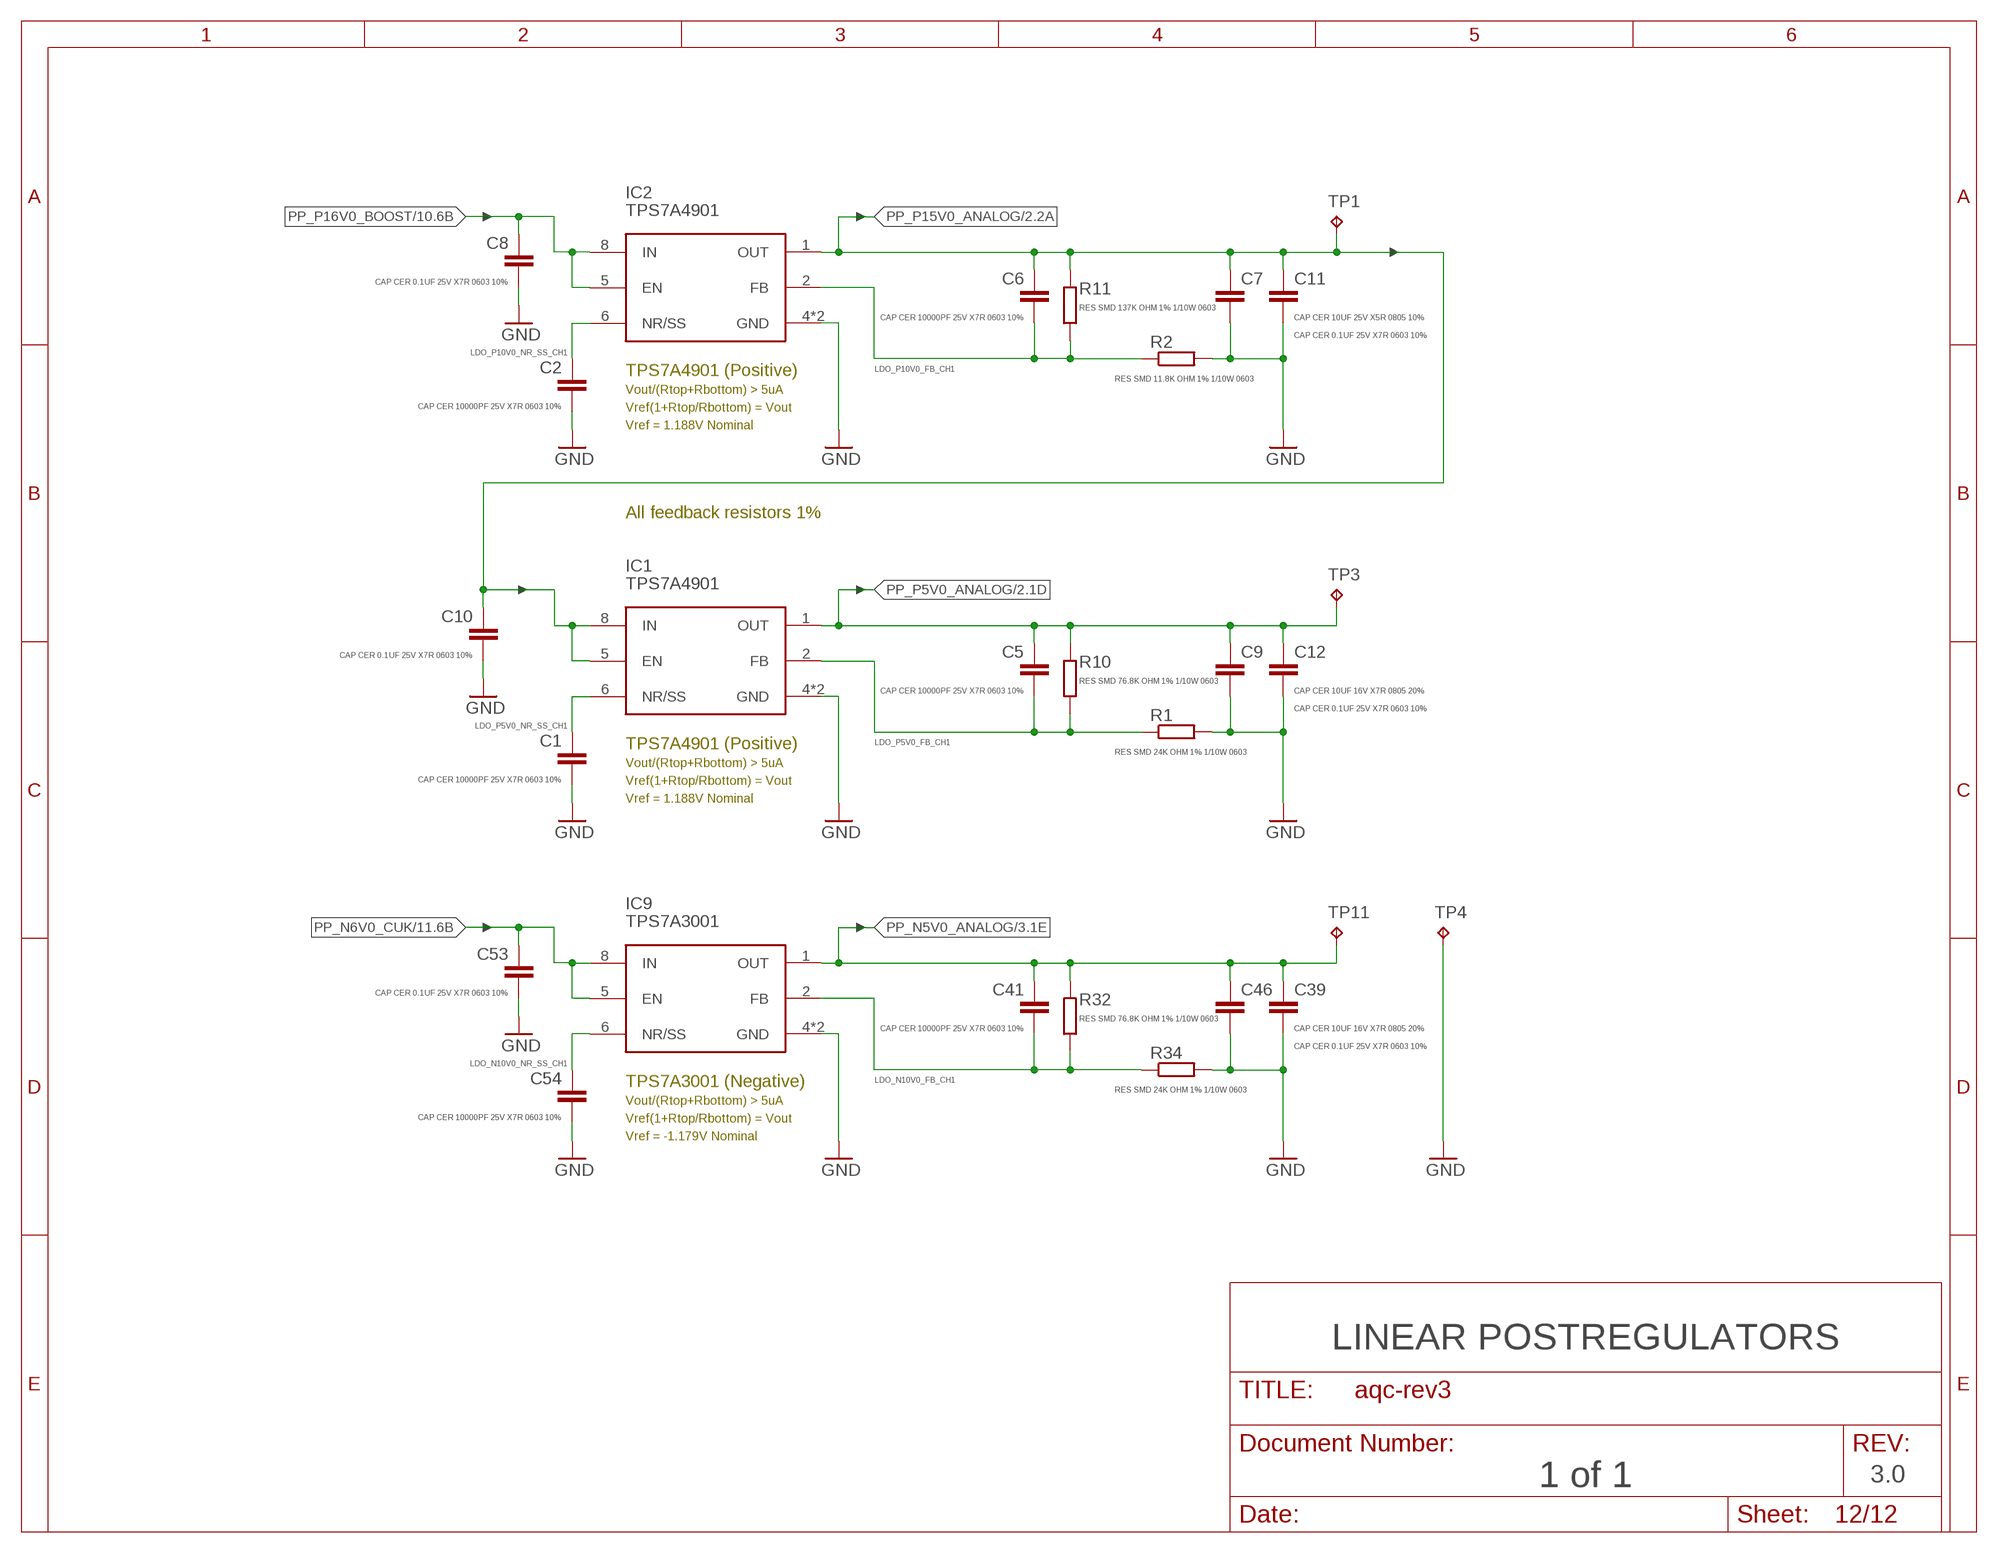
[diagram p11: schematic, sheet 12]

### Parts
C1  CAP CER 10000PF 25V X7R 0603 10%  C-EUC0603  [C0603]
C2  CAP CER 10000PF 25V X7R 0603 10%  C-EUC0603  [C0603]
C5  CAP CER 10000PF 25V X7R 0603 10%  C-EUC0603  [C0603]
C6  CAP CER 10000PF 25V X7R 0603 10%  C-EUC0603  [C0603]
C7  CAP CER 0.1UF 25V X7R 0603 10%  C-EUC0603  [C0603]
C8  CAP CER 0.1UF 25V X7R 0603 10%  C-EUC0603  [C0603]
C9  CAP CER 0.1UF 25V X7R 0603 10%  C-EUC0603  [C0603]
C10  CAP CER 0.1UF 25V X7R 0603 10%  C-EUC0603  [C0603]
C11  CAP CER 10UF 25V X5R 0805 10%  C-EUC0805  [C0805]
C12  CAP CER 10UF 16V X7R 0805 20%  C-EUC0805  [C0805]
C39  CAP CER 10UF 16V X7R 0805 20%  C-EUC0805  [C0805]
C41  CAP CER 10000PF 25V X7R 0603 10%  C-EUC0603  [C0603]
C46  CAP CER 0.1UF 25V X7R 0603 10%  C-EUC0603  [C0603]
C53  CAP CER 0.1UF 25V X7R 0603 10%  C-EUC0603  [C0603]
C54  CAP CER 10000PF 25V X7R 0603 10%  C-EUC0603  [C0603]
IC1  TPS7A4901  TPS7A  [MSOP-8_POWER_PAD]
IC2  TPS7A4901  TPS7A  [MSOP-8_POWER_PAD]
IC9  TPS7A3001  TPS7A  [MSOP-8_POWER_PAD]
R1  RES SMD 24K OHM 1% 1/10W 0603  R-EU_R0603  [R0603]
R2  RES SMD 11.8K OHM 1% 1/10W 0603  R-EU_R0603  [R0603]
R10  RES SMD 76.8K OHM 1% 1/10W 0603  R-EU_R0603  [R0603]
R11  RES SMD 137K OHM 1% 1/10W 0603  R-EU_R0603  [R0603]
R32  RES SMD 76.8K OHM 1% 1/10W 0603  R-EU_R0603  [R0603]
R34  RES SMD 24K OHM 1% 1/10W 0603  R-EU_R0603  [R0603]
TP1  TPTP15R  [TP15R]
TP3  TPTP15R  [TP15R]
TP4  TPTP15R  [TP15R]
TP11  TPTP15R  [TP15R]

### Nets
GND: C1.2 C2.2 C7.2 C8.2 C9.2 C10.2 C11.2 C12.2 C39.2 C46.2 C53.2 C54.2 IC1.4(GND) IC1.PAD(GND) IC2.4(GND) IC2.PAD(GND) IC9.4(GND) IC9.PAD(GND) R1.2 R2.2 R34.2 TP4.TP ; also sheet 2,3,4,5,6,7,8,9,10,11
LDO_N10V0_FB_CH1: C41.2 IC9.2(FB) R32.1 R34.1
LDO_N10V0_NR_SS_CH1: C54.1 IC9.6(NR/SS)
LDO_P5V0_FB_CH1: C5.2 IC1.2(FB) R1.1 R10.1
LDO_P5V0_NR_SS_CH1: C1.1 IC1.6(NR/SS)
LDO_P10V0_FB_CH1: C6.2 IC2.2(FB) R2.1 R11.1
LDO_P10V0_NR_SS_CH1: C2.1 IC2.6(NR/SS)
PP_N5V0_ANALOG: C39.1 C41.1 C46.1 IC9.1(OUT) R32.2 TP11.TP ; also sheet 3,4,5
PP_N6V0_CUK: C53.1 IC9.5(EN) IC9.8(IN) ; also sheet 11
PP_P5V0_ANALOG: C5.1 C9.1 C12.1 IC1.1(OUT) R10.2 TP3.TP ; also sheet 2,3,4,5,7
PP_P15V0_ANALOG: C6.1 C7.1 C10.1 C11.1 IC1.5(EN) IC1.8(IN) IC2.1(OUT) R11.2 TP1.TP ; also sheet 2,3
PP_P16V0_BOOST: C8.1 IC2.5(EN) IC2.8(IN) ; also sheet 10

### Notes on the sheet
- TPS7A4901 (Positive)
- Vout/(Rtop+Rbottom) > 5uA
- Vref(1+Rtop/Rbottom) = Vout
- Vref = 1.188V Nominal
- All feedback resistors 1%
- TPS7A4901 (Positive)
- Vout/(Rtop+Rbottom) > 5uA
- Vref(1+Rtop/Rbottom) = Vout
- Vref = 1.188V Nominal
- TPS7A3001 (Negative)
- Vout/(Rtop+Rbottom) > 5uA
- Vref(1+Rtop/Rbottom) = Vout
- Vref = -1.179V Nominal
- LINEAR POSTREGULATORS
- 1 of 1 | 3.0

## Power pins joined to a net without a drawn wire
GND: X1.G@2(GND) X1.G@3(GND) X1.G@4(GND) X2.G@2(GND) X2.G@3(GND) X2.G@4(GND) X4.G@2(GND) X4.G@3(GND) X4.G@4(GND) X5.G@2(GND) X5.G@3(GND) X5.G@4(GND) X7.G@2(GND) X7.G@3(GND) X7.G@4(GND)
VBB: U3.4(VBB)

## Library data of the parts
C1 C2 C5-C10 C16 C20-C24 C28-C30 C33-C38 C40 C41 C43 C44 C46-C55 C58 C59 C62-C64 C70 C72 C75-C78 C80 C84 C85 C88-C90 C93 C94 C96 C99 C104 C109 = rcl-modified-footprints:C-EU: CAPACITOR, European symbol
C3 C4 C11 C12 C15 C17-C19 C27 C31 C32 C39 C45 C56 C57 C60 C61 C65-C69 C71 C73 C74 C79 C81-C83 C86 C87 C91 C92 C95 C97 C98 C100-C103 C105-C108 C110-C113 = rcl:C-EU: CAPACITOR, European symbol
C13 C14 C25 C26 C42 = rcl:CPOL-EU: POLARIZED CAPACITOR, European symbol
D1-D3 = diode:DIODE-: DIODE
D4 D5 = diode:BAS40: Silicon Schottky Diodes General-purpose diode for high-speed switching
DNP1000 = meng:RLE_LOGO
H1-H4 = holes:MOUNT-PAD-ROUND: MOUNTING PAD, round
IC1 IC2 IC9 = Kramnik's Library:TPS7A*
IC3 IC10 = meng:LT1534
IC4 = meng:ADCMP582: Ultrafast SiGe Voltage Comparator w/. PECL Outputs http://www.analog.com/media/en/technical-documentation/data-sheets/ADCMP580_581_582.pdf
IC5 IC11-IC13 IC23 IC27 = meng:HFA3134
IC6 IC8 = meng:HFA3135
IC7 = meng:DS1100L
IC14 = meng:LTC1711
IC15 = meng:NC7SV74K8X
IC16 = 74xx-little-de:74*1G14: Single Schmitt-Trigger Inverter Gate
IC17 = 74xx-little-de:74*1G125: Single Bus Buffer Gate with 3-State Output
IC18 = 74xx-little-de:74*1G04: INVERTER Gate
IC19 = 74xx-little-de:74*1G32: 2-input OR gate
IC20 = meng:NC7WZ16P6X
IC21 IC22 = 74xx-little-de:74*1G08: 2-input AND gate
IC24 IC26 = meng:TLV272
IC25 = meng:THAT320
IC28 = meng:TLV271
IC29 = meng:USBLC6
IC30 = meng:STM32F405RG: ARM DSP Chip used on the WAV Trigger board.; VALUE: STM32F405RG
IC31 = meng:MAX572X
IC32 = meng:LM1117
L1 L4 L5 L7-L10 = meng:INDUCTOR
L2 = meng:WE_INDUCTOR
L3 L6 = meng:SRF0703; VALUE: SRF0703
LED1 = meng:CBI-564-0X00-XXX-3LED; VALUE: 564-0x00-xxx
M1 M2 = meng:BSS806N
PROG = SparkFun-Connectors:JST_VERTICAL; PROD_ID: CONN-08249
Q1 = microbuilder:MOSFET-P: P-Channel Mosfet LEGEND VDS: Voltage Drain-Source ID: Drain Current RDS(ON): Drain-Source On-State Resistance VGS(TH): Gate-Source Threshold Voltage CISS: Drain-Source Input Capacitance SOT-23 Name VDS ID RDS(ON) VGS(TH) CISS Order Number IRLML5103 30V 760mA 600 mOhm -- 75pF @ 25V Digikey: IRLML5103PBFCT-ND IRLML6401 12V 4.3A 50 mOhm 950mV @ 250µA 830pF @ 10V Digikey: IRLML6401PBFTR-ND NTR0202PL 20V 400mA 800 mOhm 2.3V @ 250uA 70pF @ 5V Digikey: NTR0202PLT1GOSTR-ND NTR4101PT1G 20V 1.8A 85 mOhm 1.2V @ 250uA 675pF @ 10V Digikey: NTR4101PT1GOSCT-ND DMP2004K 20V 600mA 900 mOhm 1V @ 250uA 175pF @ 16V Digikey: DMP2004KDICT-ND PMV65XP 20V 3.9A 76 mOhm 950mV @ 1mA 725pF @ 20V Digikey: 568-2358-2-ND TO-252 Name VDS ID RDS(ON) VGS(TH) CISS Order Number AOD417 30V 25A 34 mOhm 3V @ 250µA 920pF @ 15V Digikey: 785-1106-2-ND
R1-R6 R9-R13 R17-R28 R31-R40 R42 R46 R47 R50 R51 R53 R54 R56 R57 R59 R61 R63 R64 R66 R69 R71 R72 R74 = rcl-modified-footprints:R-EU_: RESISTOR, European symbol
R7 R8 R14-R16 R29 R41 R43 R44 R48 R55 R58 R60 R62 R65 R67 R70 = resistor:R-EU_: RESISTOR, European symbol
R30 R45 R49 R52 R73 R75 R76 = rcl:R-EU_: RESISTOR, European symbol
R68 = meng:DIVIDER_SOT23-5
RLY1 RLY2 = meng:MEDER_CRF05-1A: MEDER CRF05-1A RF Reed Relay in a ceramic surface mount package.
SW1 = meng:E-SWITCH-TL3305AF160QG
T1 = transistor:*-NPN-: NPN Transistror BF959 corrected 2008.03.06
TP1-TP4 TP7 TP8 TP10-TP13 TP23 = testpad:TP: Test pad
TP5 TP6 TP14-TP22 = Kramnik's Library:KEYSTONE_5000
TP9 = meng:TP-SCOPE
U1 = microbuilder:DAC_MCP4725: MCP4725 - 12-Bit I2C DAC with on-board EEPROM Settling Time: 6 µs 2.7-5.5V Supply 100kHz, 400kHz, 3.4 Mbps I²C EEPROM can be used to store a specific output voltage which will be set coming out of reset I²C Address: 1100 A2 A1 A0 A0 is set via the A0 pin, A2 and A1 are hard-wired on the chip depending on the model chosen: Part Number A2 A1 Code MCP4725A0T-E/CH 0 0 AJNN MCP4725A1T-E/CH 0 1 APNN MCP4725A2T-E/CH 1 0 AQNN MCP4725A3T-E/CH 1 1 ARNN
U2 = Texas Instruments_By_element14_Batch_1:SN65EPT22DGK: Dual LVTTL/LVCMOS to Differential LVPECL Buffer; MPN: SN65EPT22DGK; OC_FARNELL: -; OC_NEWARK: 45P8158; PACKAGE: MSOP-8; SUPPLIER: Texas Instruments
U3 = Texas Instruments_By_element14_Batch_1:SN65EPT21DGK: 3.3-V Differential PECL/LVDS to TTL Translator; MPN: SN65EPT21DGK; OC_FARNELL: -; OC_NEWARK: 74R6512; PACKAGE: MSOP-8; SUPPLIER: Texas Instruments
X1 X2 = meng:SMA-: SMA 50 Ohm End Launch Jack Receptacle - Round Contact Johnson Components Source: www.johnsoncomponents.com .. J502-ND.pdf; MF: JOHNSON COMPONENTS; MPN: 142-0711-871; OC_FARNELL: unknown; OC_NEWARK: 01C1639
X3 X6 = meng:KEYSTONE-7774
X4 X5 X7 = meng:SMA-: SMA 50 Ohm End Launch Jack Receptacle - Round Contact Johnson Components Source: www.johnsoncomponents.com .. J502-ND.pdf; MF: JOHNSON COMPONENTS; MPN: 142-0701-881; OC_FARNELL: 1608603; OC_NEWARK: 08B906
X8 = con-berg:PN61729-S: BERG USB connector; OC_FARNELL: unknown; OC_NEWARK: unknown
XTAL1 = meng:MURATA_CSTCE_G15L/CSTCE_GH5L; VALUE: CSTCE_G15L/CSTCE_GH5L

## Net classes
1 100OHM_DIFF: width 0.254 mm, clearance 0.254 mm